# EAGLE design base-1 (EAGLE 9.3.1)
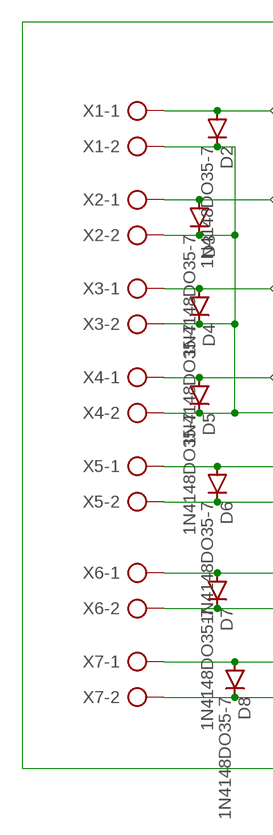
[diagram p0: schematic, sheet 1, part 1 of 2]
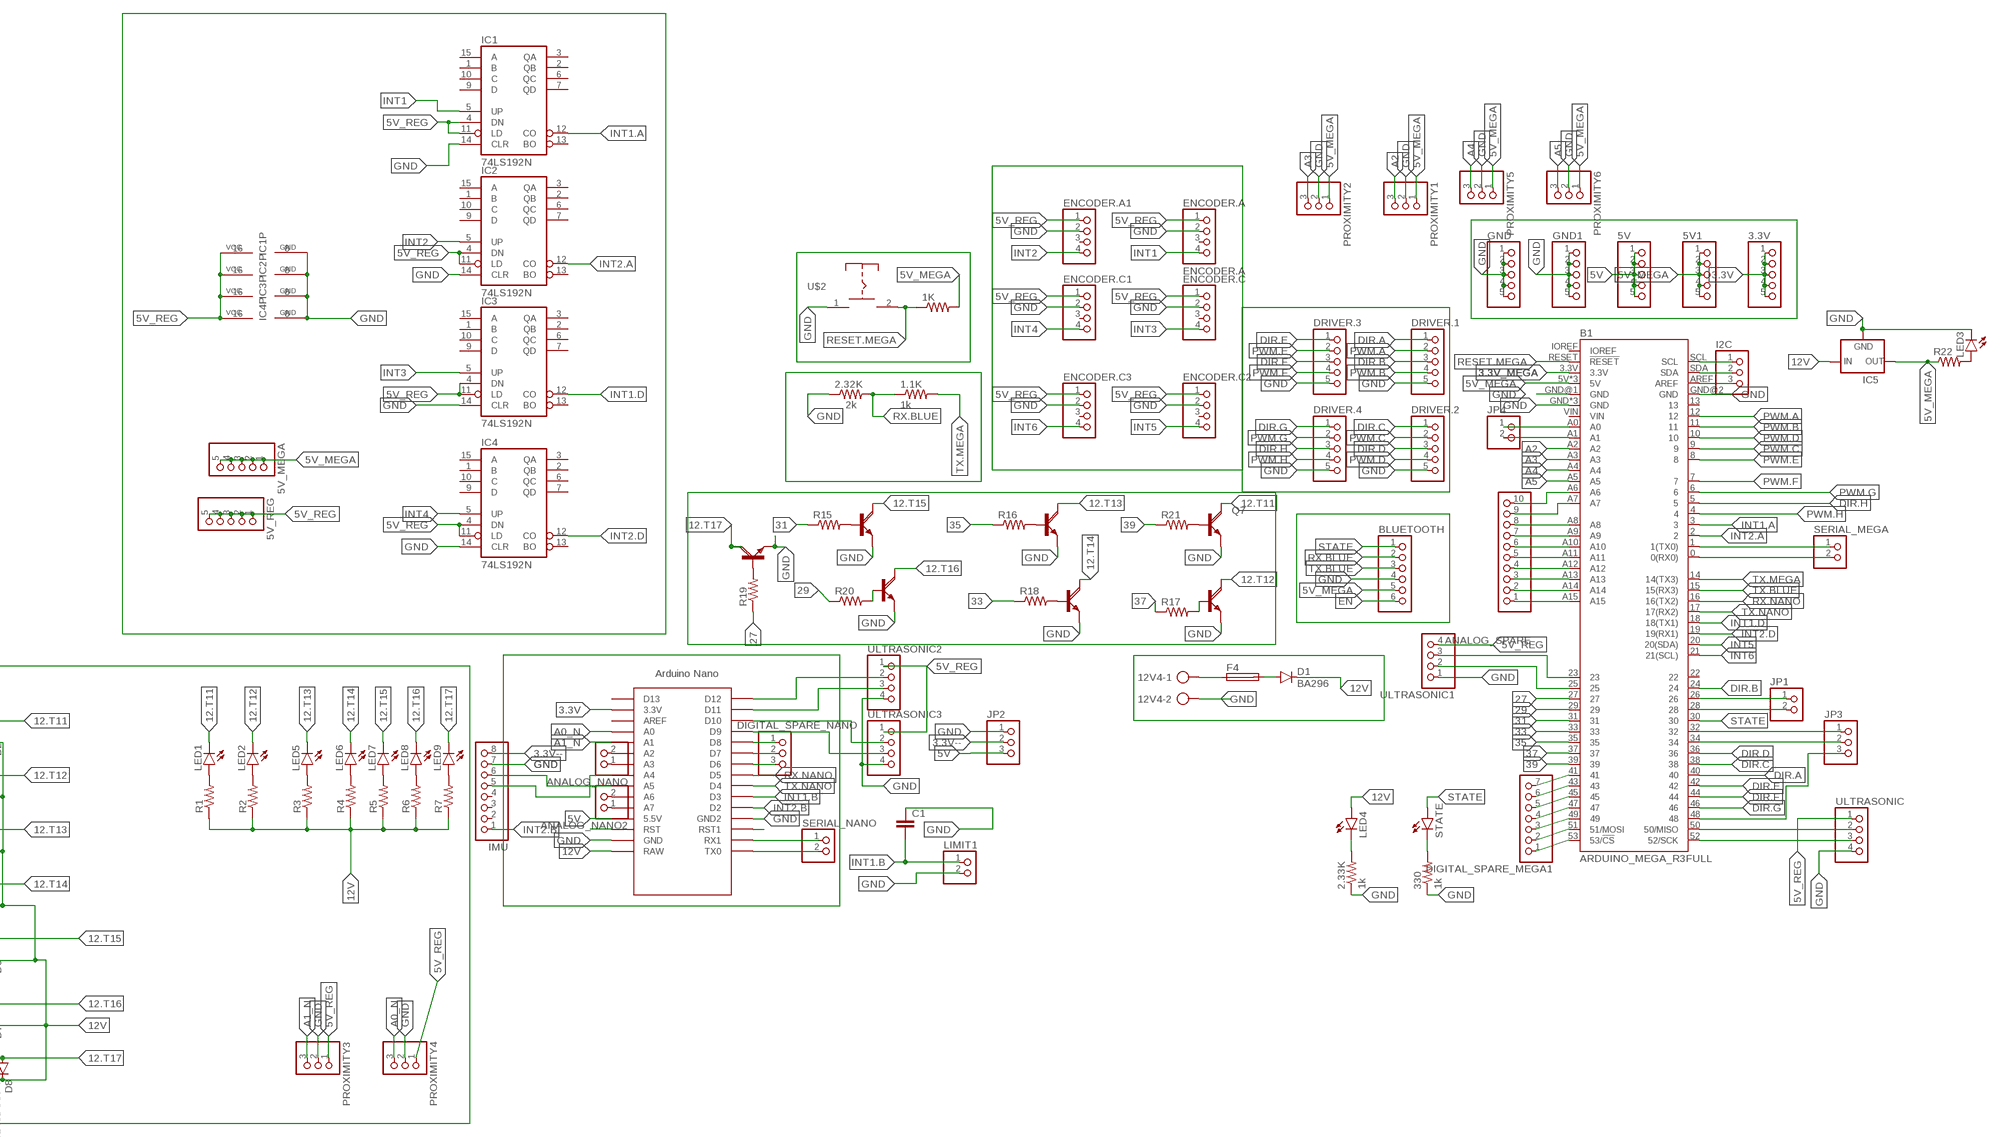
[diagram p1: schematic, sheet 1, part 2 of 2]

## Parts
1.1K  1k  R-US_0204/5  [0204/5]
1K  R-US_0204/5  [0204/5]
2.32K  2k  R-US_0204/5  [0204/5]
2.33K  1k  R-US_0207/10  [0207/10]
3.3V  PINHD-1X5  [1X05]
5V  PINHD-1X5  [1X05]
5V1  PINHD-1X5  [1X05]
5V_MEGA  PINHD-1X5  [1X05]
5V_REG  PINHD-1X5  [1X05]
12V4  W237-113  [W237-113]
330  1k  R-US_0204/5  [0204/5]
ANALOG_NANO  PINHD-1X2  [1X02]
ANALOG_NANO2  PINHD-1X2  [1X02]
ANALOG_SPARE  PINHD-1X10  [1X10]
B1  ARDUINO_MEGA_R3FULL  [ARDUINO_MEGA_NO_SILK]
BLUETOOTH  PINHD-1X6  [1X06]
C1  C-EU025-025X050  [C025-025X050]
D1  BA296  [P2-15]
D2  1N4148DO35-7  [DO35-7]
D3  1N4148DO35-7  [DO35-7]
D4  1N4148DO35-7  [DO35-7]
D5  1N4148DO35-7  [DO35-7]
D6  1N4148DO35-7  [DO35-7]
D7  1N4148DO35-7  [DO35-7]
D8  1N4148DO35-7  [DO35-7]
DIGITAL_SPARE_MEGA1  PINHD-1X7  [1X07]
DIGITAL_SPARE_NANO  PINHD-1X3  [1X03]
DRIVER.1  PINHD-1X5  [1X05]
DRIVER.2  PINHD-1X5  [1X05]
DRIVER.3  PINHD-1X5  [1X05]
DRIVER.4  PINHD-1X5  [1X05]
ENCODER.A  ENCODER.A  PINHD-1X4  [1X04]
ENCODER.A1  PINHD-1X4  [1X04]
ENCODER.C  PINHD-1X4  [1X04]
ENCODER.C1  PINHD-1X4  [1X04]
ENCODER.C2  PINHD-1X4  [1X04]
ENCODER.C3  PINHD-1X4  [1X04]
F4  SH22,5A  [SH22,5A]
GND  PINHD-1X5  [1X05]
GND1  PINHD-1X5  [1X05]
I2C  PINHD-1X3  [1X03]
IC1  74LS192N  [DIL16]
IC2  74LS192N  [DIL16]
IC3  74LS192N  [DIL16]
IC4  74LS192N  [DIL16]
IC5  79XX-TO3  [TO3-79]
IMU  PINHD-1X8  [1X08]
JP1  PINHD-1X2  [1X02]
JP2  PINHD-1X3  [1X03]
JP3  PINHD-1X3  [1X03]
JP4  PINHD-1X2  [1X02]
LED1  LED3MM  [LED3MM]
LED2  LED3MM  [LED3MM]
LED3  LED3MM  [LED3MM]
LED4  LED5MM  [LED5MM]
LED5  LED3MM  [LED3MM]
LED6  LED3MM  [LED3MM]
LED7  LED3MM  [LED3MM]
LED8  LED3MM  [LED3MM]
LED9  LED3MM  [LED3MM]
LIMIT1  PINHD-1X2  [1X02]
PROXIMITY1  PINHD-1X3  [1X03]
PROXIMITY2  PINHD-1X3  [1X03]
PROXIMITY3  PINHD-1X3  [1X03]
PROXIMITY4  PINHD-1X3  [1X03]
PROXIMITY5  PINHD-1X3  [1X03]
PROXIMITY6  PINHD-1X3  [1X03]
Q1  TIP120  [TO220AV]
Q2  TIP120  [TO220AV]
Q3  TIP120  [TO220AV]
Q4  TIP120  [TO220AV]
Q5  TIP120  [TO220AV]
Q6  TIP120  [TO220AV]
Q7  TIP120  [TO220AV]
R1  R-US_0204/5  [0204/5]
R2  R-US_0204/5  [0204/5]
R3  R-US_0204/5  [0204/5]
R4  R-US_0204/5  [0204/5]
R5  R-US_0204/5  [0204/5]
R6  R-US_0204/5  [0204/5]
R7  R-US_0204/5  [0204/5]
R15  R-US_0207/10  [0207/10]
R16  R-US_0204/7  [0204/7]
R17  R-US_0204/7  [0204/7]
R18  R-US_0204/7  [0204/7]
R19  R-US_0204/7  [0204/7]
R20  R-US_0204/7  [0204/7]
R21  R-US_0204/5  [0204/5]
R22  R-US_0204/5  [0204/5]
SERIAL_MEGA  PINHD-1X2  [1X02]
SERIAL_NANO  PINHD-1X2  [1X02]
STATE  LED3MM  [LED3MM]
U$1  NANO  [NANO]
U$2  PUSHBOTTON  [PUSHBOTTON]
ULTRASONIC  PINHD-1X4  [1X04]
ULTRASONIC1  PINHD-1X4  [1X04]
ULTRASONIC2  PINHD-1X4  [1X04]
ULTRASONIC3  PINHD-1X4  [1X04]
X1  AK300/2  [AK300/2]
X2  AK300/2  [AK300/2]
X3  AK300/2  [AK300/2]
X4  AK300/2  [AK300/2]
X5  AK300/2  [AK300/2]
X6  AK300/2  [AK300/2]
X7  AK300/2  [AK300/2]

## Nets
3.3V: 3.3V.1 3.3V.2 3.3V.3 3.3V.4 3.3V.5 U$1.3.3V
3.3V--: IMU.8 JP2.2
3.3V_MEGA: B1.3.3V
5V: 5V.1 5V.2 5V.3 5V.4 5V.5 JP2.3 U$1.5V(5.5V)
5V_MEGA: 1K.2 5V1.1 5V1.2 5V1.3 5V1.4 5V1.5 5V_MEGA.1 5V_MEGA.2 5V_MEGA.3 5V_MEGA.4 5V_MEGA.5 B1.5V B1.5V@1(5V) B1.5V@2(5V) BLUETOOTH.5 IC5.1(OUT) PROXIMITY1.1 PROXIMITY2.1 PROXIMITY5.1 PROXIMITY6.1 R22.1
5V_REG: 5V_REG.1 5V_REG.2 5V_REG.3 5V_REG.4 5V_REG.5 ENCODER.A1.1 ENCODER.A.1 ENCODER.C1.1 ENCODER.C2.1 ENCODER.C3.1 ENCODER.C.1 IC1.4(DN) IC1.11(LD) IC1.16(VCC) IC2.4(DN) IC2.11(LD) IC2.16(VCC) IC3.4(DN) IC3.11(LD) IC3.16(VCC) IC4.4(DN) IC4.11(LD) IC4.16(VCC) PROXIMITY3.1 PROXIMITY4.1 ULTRASONIC1.4 ULTRASONIC2.1 ULTRASONIC3.1 ULTRASONIC.1
12.T11: D2.A LED1.K(C) Q7.C X1.1
12.T12: D3.A LED2.K(C) Q5.C X2.1
12.T13: D4.A LED5.K(C) Q2.C X3.1
12.T14: D5.A LED6.K(C) Q4.C X4.1
12.T15: D6.A LED7.K(C) Q1.C X5.1
12.T16: D7.A LED8.K(C) Q6.C X6.1
12.T17: D8.A LED9.K(C) Q3.C X7.1
12V: D1.C D2.C D3.C D4.C D5.C D6.C D7.C D8.C IC5.3(IN) LED4.A R1.1 R2.1 R3.1 R4.1 R5.1 R6.1 R7.1 U$1.RAW X1.2 X2.2 X3.2 X4.2 X5.2 X6.2 X7.2
27: B1.27 R19.1
29: B1.29 R20.1
31: B1.31 R15.1
33: B1.33 R18.1
35: B1.35 R16.1
37: B1.37 R17.1
39: B1.39 R21.1
48: B1.48 JP3.3
A0_N: PROXIMITY4.3 U$1.A0
A1_N: PROXIMITY3.3 U$1.A1
A2: B1.A2 PROXIMITY1.3
A3: B1.A3 PROXIMITY2.3
A4: B1.A4 PROXIMITY5.3
A5: B1.A5 PROXIMITY6.3
DIR.A: B1.40 DRIVER.1.1
DIR.B: B1.24 DRIVER.1.3
DIR.C: B1.38 DRIVER.2.1
DIR.D: B1.36 DRIVER.2.3
DIR.E: B1.42 DRIVER.3.1
DIR.F: B1.44 DRIVER.3.3
DIR.G: B1.46 DRIVER.4.1
DIR.H: B1.5 DRIVER.4.3
EN: BLUETOOTH.6
GND: 2.32K.1 2.33K.1 12V4.2 330.1 B1.GND B1.GND@1(GND) B1.GND@2(GND) B1.GND@3(GND) B1.GND@4(GND) BLUETOOTH.4 C1.1 DRIVER.1.5 DRIVER.2.5 DRIVER.3.5 DRIVER.4.5 ENCODER.A1.2 ENCODER.A.2 ENCODER.C1.2 ENCODER.C2.2 ENCODER.C3.2 ENCODER.C.2 GND1.1 GND1.2 GND1.3 GND1.4 GND1.5 GND.1 GND.2 GND.3 GND.4 GND.5 IC1.8(GND) IC1.14(CLR) IC2.8(GND) IC2.14(CLR) IC3.8(GND) IC3.14(CLR) IC4.8(GND) IC4.14(CLR) IC5.2(GND) IMU.7 JP2.1 LED3.K(C) LIMIT1.2 PROXIMITY1.2 PROXIMITY2.2 PROXIMITY3.2 PROXIMITY4.2 PROXIMITY5.2 PROXIMITY6.2 Q1.E Q2.E Q3.E Q4.E Q5.E Q6.E Q7.E U$1.GND U$1.GND1(GND2) U$2.1 ULTRASONIC1.1 ULTRASONIC2.4 ULTRASONIC3.4 ULTRASONIC.4
INT1: ENCODER.A.4 IC1.5(UP)
INT1.A: B1.3 IC1.12(CO)
INT1.B: C1.2 LIMIT1.1 U$1.D3
INT1.D: B1.18(18(TX1)) IC3.12(CO)
INT2: ENCODER.A1.4 IC2.5(UP)
INT2.A: B1.2 IC2.12(CO)
INT2.B: IMU.1 U$1.D2
INT2.D: B1.19(19(RX1)) IC4.12(CO)
INT3: ENCODER.C.4 IC3.5(UP)
INT4: ENCODER.C1.4 IC4.5(UP)
INT5: B1.20(20(SDA)) ENCODER.C2.4
INT6: B1.21(21(SCL)) ENCODER.C3.4
N$1: B1.SCL I2C.1
N$2: B1.SDA I2C.2
N$3: B1.AREF I2C.3
N$6: ANALOG_SPARE.1 B1.A15
N$7: 12V4.1 F4.1
N$8: ANALOG_SPARE.2 B1.A14
N$9: ANALOG_SPARE.3 B1.A13
N$10: ANALOG_SPARE.4 B1.A12
N$11: ANALOG_SPARE.5 B1.A11
N$12: ANALOG_SPARE.6 B1.A10
N$13: ANALOG_SPARE.7 B1.A9
N$14: ANALOG_SPARE.8 B1.A8
N$15: ANALOG_SPARE.9 B1.A7
N$16: LED3.A R22.2
N$17: B1.1(1(TX0)) SERIAL_MEGA.1
N$18: B1.0(0(RX0)) SERIAL_MEGA.2
N$21: 330.2 STATE.K(C)
N$23: Q5.B R17.2
N$24: 2.33K.2 LED4.K(C)
N$25: D1.A F4.2
N$26: Q6.B R20.2
N$27: LED1.A R1.2
N$28: LED2.A R2.2
N$29: LED5.A R3.2
N$30: LED6.A R4.2
N$31: LED7.A R5.2
N$32: LED8.A R6.2
N$33: LED9.A R7.2
N$35: B1.23 ULTRASONIC1.3
N$36: B1.25 ULTRASONIC1.2
N$37: IMU.6 U$1.A5
N$38: IMU.5 U$1.A4
N$39: ANALOG_NANO.1 U$1.A3
N$40: ANALOG_NANO.2 U$1.A2
N$41: B1.50(50/MISO) ULTRASONIC.2
N$42: B1.52(52/SCK) ULTRASONIC.3
N$43: ANALOG_NANO2.1 U$1.A7
N$44: ANALOG_NANO2.2 U$1.A6
N$45: B1.A0 JP4.1
N$46: B1.26 JP1.1
N$47: ANALOG_SPARE.10 B1.A6
N$48: B1.A1 JP4.2
N$50: B1.28 JP1.2
N$54: B1.32 JP3.1
N$55: B1.34 JP3.2
N$60: Q1.B R15.2
N$61: Q2.B R16.2
N$62: Q4.B R18.2
N$63: Q3.B R19.2
N$64: Q7.B R21.2
N$75: B1.41 DIGITAL_SPARE_MEGA1.7
N$76: B1.45 DIGITAL_SPARE_MEGA1.5
N$77: B1.43 DIGITAL_SPARE_MEGA1.6
N$78: B1.47 DIGITAL_SPARE_MEGA1.4
N$79: B1.49 DIGITAL_SPARE_MEGA1.3
N$80: B1.51(51/MOSI) DIGITAL_SPARE_MEGA1.2
N$81: B1.53(53/!CS) DIGITAL_SPARE_MEGA1.1
N$119: U$1.RST
N$122: U$1.D12 ULTRASONIC2.2
N$123: U$1.D11 ULTRASONIC2.3
N$124: U$1.D10 ULTRASONIC3.2
N$125: U$1.D9 ULTRASONIC3.3
N$126: DIGITAL_SPARE_NANO.1 U$1.D8
N$127: DIGITAL_SPARE_NANO.2 U$1.D7
N$128: DIGITAL_SPARE_NANO.3 U$1.D6
N$134: U$1.RST1
N$135: SERIAL_NANO.1 U$1.RX1
N$136: SERIAL_NANO.2 U$1.TX0
PWM.A: B1.12 DRIVER.1.2
PWM.B: B1.11 DRIVER.1.4
PWM.C: B1.9 DRIVER.2.2
PWM.D: B1.10 DRIVER.2.4
PWM.E: B1.8 DRIVER.3.2
PWM.F: B1.7 DRIVER.3.4
PWM.G: B1.6 DRIVER.4.2
PWM.H: B1.4 DRIVER.4.4
RESET.MEGA: 1K.1 B1.RESET(!RESET) U$2.2
RX.BLUE: 1.1K.1 2.32K.2 BLUETOOTH.2
RX.NANO: B1.16(16(TX2)) U$1.D5
STATE: B1.30 BLUETOOTH.1 STATE.A
TX.BLUE: B1.15(15(RX3)) BLUETOOTH.3
TX.MEGA: 1.1K.2 B1.14(14(TX3))
TX.NANO: B1.17(17(RX2)) U$1.D4
Unconnected: B1.13 B1.22 B1.IOREF B1.VIN ENCODER.A1.3 ENCODER.A.3 ENCODER.C1.3 ENCODER.C2.3 ENCODER.C3.3 ENCODER.C.3 IC1.1(B) IC1.2(QB) IC1.3(QA) IC1.6(QC) IC1.7(QD) IC1.9(D) IC1.10(C) IC1.13(BO) IC1.15(A) IC2.1(B) IC2.2(QB) IC2.3(QA) IC2.6(QC) IC2.7(QD) IC2.9(D) IC2.10(C) IC2.13(BO) IC2.15(A) IC3.1(B) IC3.2(QB) IC3.3(QA) IC3.6(QC) IC3.7(QD) IC3.9(D) IC3.10(C) IC3.13(BO) IC3.15(A) IC4.1(B) IC4.2(QB) IC4.3(QA) IC4.6(QC) IC4.7(QD) IC4.9(D) IC4.10(C) IC4.13(BO) IC4.15(A) IMU.2 IMU.3 IMU.4 U$1.AREF U$1.D13

## Library data of the parts
1.1K 1K 2.32K 2.33K 330 R1-R7 R15-R22 = rcl:R-US_: RESISTOR, American symbol; SPICEPREFIX: R
3.3V 5V 5V1 5V_MEGA 5V_REG DRIVER.1-DRIVER.4 GND GND1 = pinhead:PINHD-1X5: PIN HEADER
12V4 = con-wago-500:W237-113: WAGO SCREW CLAMP; OC_FARNELL: unknown; OC_NEWARK: unknown
ANALOG_NANO ANALOG_NANO2 JP1 JP4 LIMIT1 SERIAL_MEGA SERIAL_NANO = pinhead:PINHD-1X2: PIN HEADER
ANALOG_SPARE = pinhead:PINHD-1X10: PIN HEADER
B1 = SparkFun-Boards:ARDUINO_MEGA_R3: Arduino Mega R3 ATmega2560 R3 compatible footprint. SparkFun Products: Arduino Mega 2560 R3 <https://www.sparkfun.com/products/11061>
BLUETOOTH = pinhead:PINHD-1X6: PIN HEADER
C1 = rcl:C-EU: CAPACITOR, European symbol; SPICEPREFIX: C
D1 = diode:BA296: DIODE
D2-D8 = diode:1N4148: DIODE high speed (Philips)
DIGITAL_SPARE_MEGA1 = pinhead:PINHD-1X7: PIN HEADER
DIGITAL_SPARE_NANO I2C JP2 JP3 PROXIMITY1-PROXIMITY6 = pinhead:PINHD-1X3: PIN HEADER
ENCODER.A ENCODER.A1 ENCODER.C ENCODER.C1-ENCODER.C3 ULTRASONIC ULTRASONIC1-ULTRASONIC3 = pinhead:PINHD-1X4: PIN HEADER
F4 = fuse:SH22,5A: FUSE HOLDER grid 22,5mm, isolated cap OGN0031 8201, Schurter (Buerklin); MPN: 0031.7701.11; OC_FARNELL: unknown; OC_NEWARK: 04F1224
IC1-IC4 = 74xx-us:74*192: Synchronous 4-bit UP/DOWN COUNTER
IC5 = v-reg:79XX-TO3: VOLTAGE REGULATOR
IMU = pinhead:PINHD-1X8: PIN HEADER
LED1-LED9 STATE = led:LED: LED OSRAM: - CHIPLED LG R971, LG N971, LY N971, LG Q971, LY Q971, LO R971, LY R971 LH N974, LH R974 LS Q976, LO Q976, LY Q976 LO Q996 - Hyper CHIPLED LW Q18S LB Q993, LB Q99A, LB R99A - SideLED LS A670, LO A670, LY A670, LG A670, LP A670 LB A673, LV A673, LT A673, LW A673 LH A674 LY A675 LS A676, LA A676, LO A676, LY A676, LW A676 LS A679, LY A679, LG A679 - Hyper Micro SIDELED® LS Y876, LA Y876, LO Y876, LY Y876 LT Y87S - SmartLED LW L88C, LW L88S LB L89C, LB L89S, LG L890 LS L89K, LO L89K, LY L89K LS L896, LA L896, LO L896, LY L896 - TOPLED LS T670, LO T670, LY T670, LG T670, LP T670 LSG T670, LSP T670, LSY T670, LOP T670, LYG T670 LG T671, LOG T671, LSG T671 LB T673, LV T673, LT T673, LW T673 LH T674 LS T676, LA T676, LO T676, LY T676, LB T676, LH T676, LSB T676, LW T676 LB T67C, LV T67C, LT T67C, LS T67K, LO T67K, LY T67K, LW E67C LS E67B, LA E67B, LO E67B, LY E67B, LB E67C, LV E67C, LT E67C LW T67C LS T679, LY T679, LG T679 LS T770, LO T770, LY T770, LG T770, LP T770 LB T773, LV T773, LT T773, LW T773 LH T774 LS E675, LA E675, LY E675, LS T675 LS T776, LA T776, LO T776, LY T776, LB T776 LHGB T686 LT T68C, LB T68C - Hyper Mini TOPLED® LB M676 - Mini TOPLED Santana® LG M470 LS M47K, LO M47K, LY M47K Source: http://www.osram.convergy.de LUXEON: - LUMILED® LXK2-PW12-R00, LXK2-PW12-S00, LXK2-PW14-U00, LXK2-PW14-V00 LXK2-PM12-R00, LXK2-PM12-S00, LXK2-PM14-U00 LXK2-PE12-Q00, LXK2-PE12-R00, LXK2-PE12-S00, LXK2-PE14-T00, LXK2-PE14-U00 LXK2-PB12-K00, LXK2-PB12-L00, LXK2-PB12-M00, LXK2-PB14-N00, LXK2-PB14-P00, LXK2-PB14-Q00 LXK2-PR12-L00, LXK2-PR12-M00, LXK2-PR14-Q00, LXK2-PR14-R00 LXK2-PD12-Q00, LXK2-PD12-R00, LXK2-PD12-S00 LXK2-PH12-R00, LXK2-PH12-S00 LXK2-PL12-P00, LXK2-PL12-Q00, LXK2-PL12-R00 Source: www.luxeon.com KINGBRIGHT: KA-3528ASYC Source: www.kingbright.com
Q1-Q7 = transistor-power:TIP120: NPN DARLINGTON TRANSISTOR
U$1 = Arduino-clone:NANO: Arduino Nano
U$2 = push botton:PUSHBOTTON
X1-X7 = con-ptr500:AK300/2: CONNECTOR; OC_FARNELL: unknown; OC_NEWARK: unknown

## Board
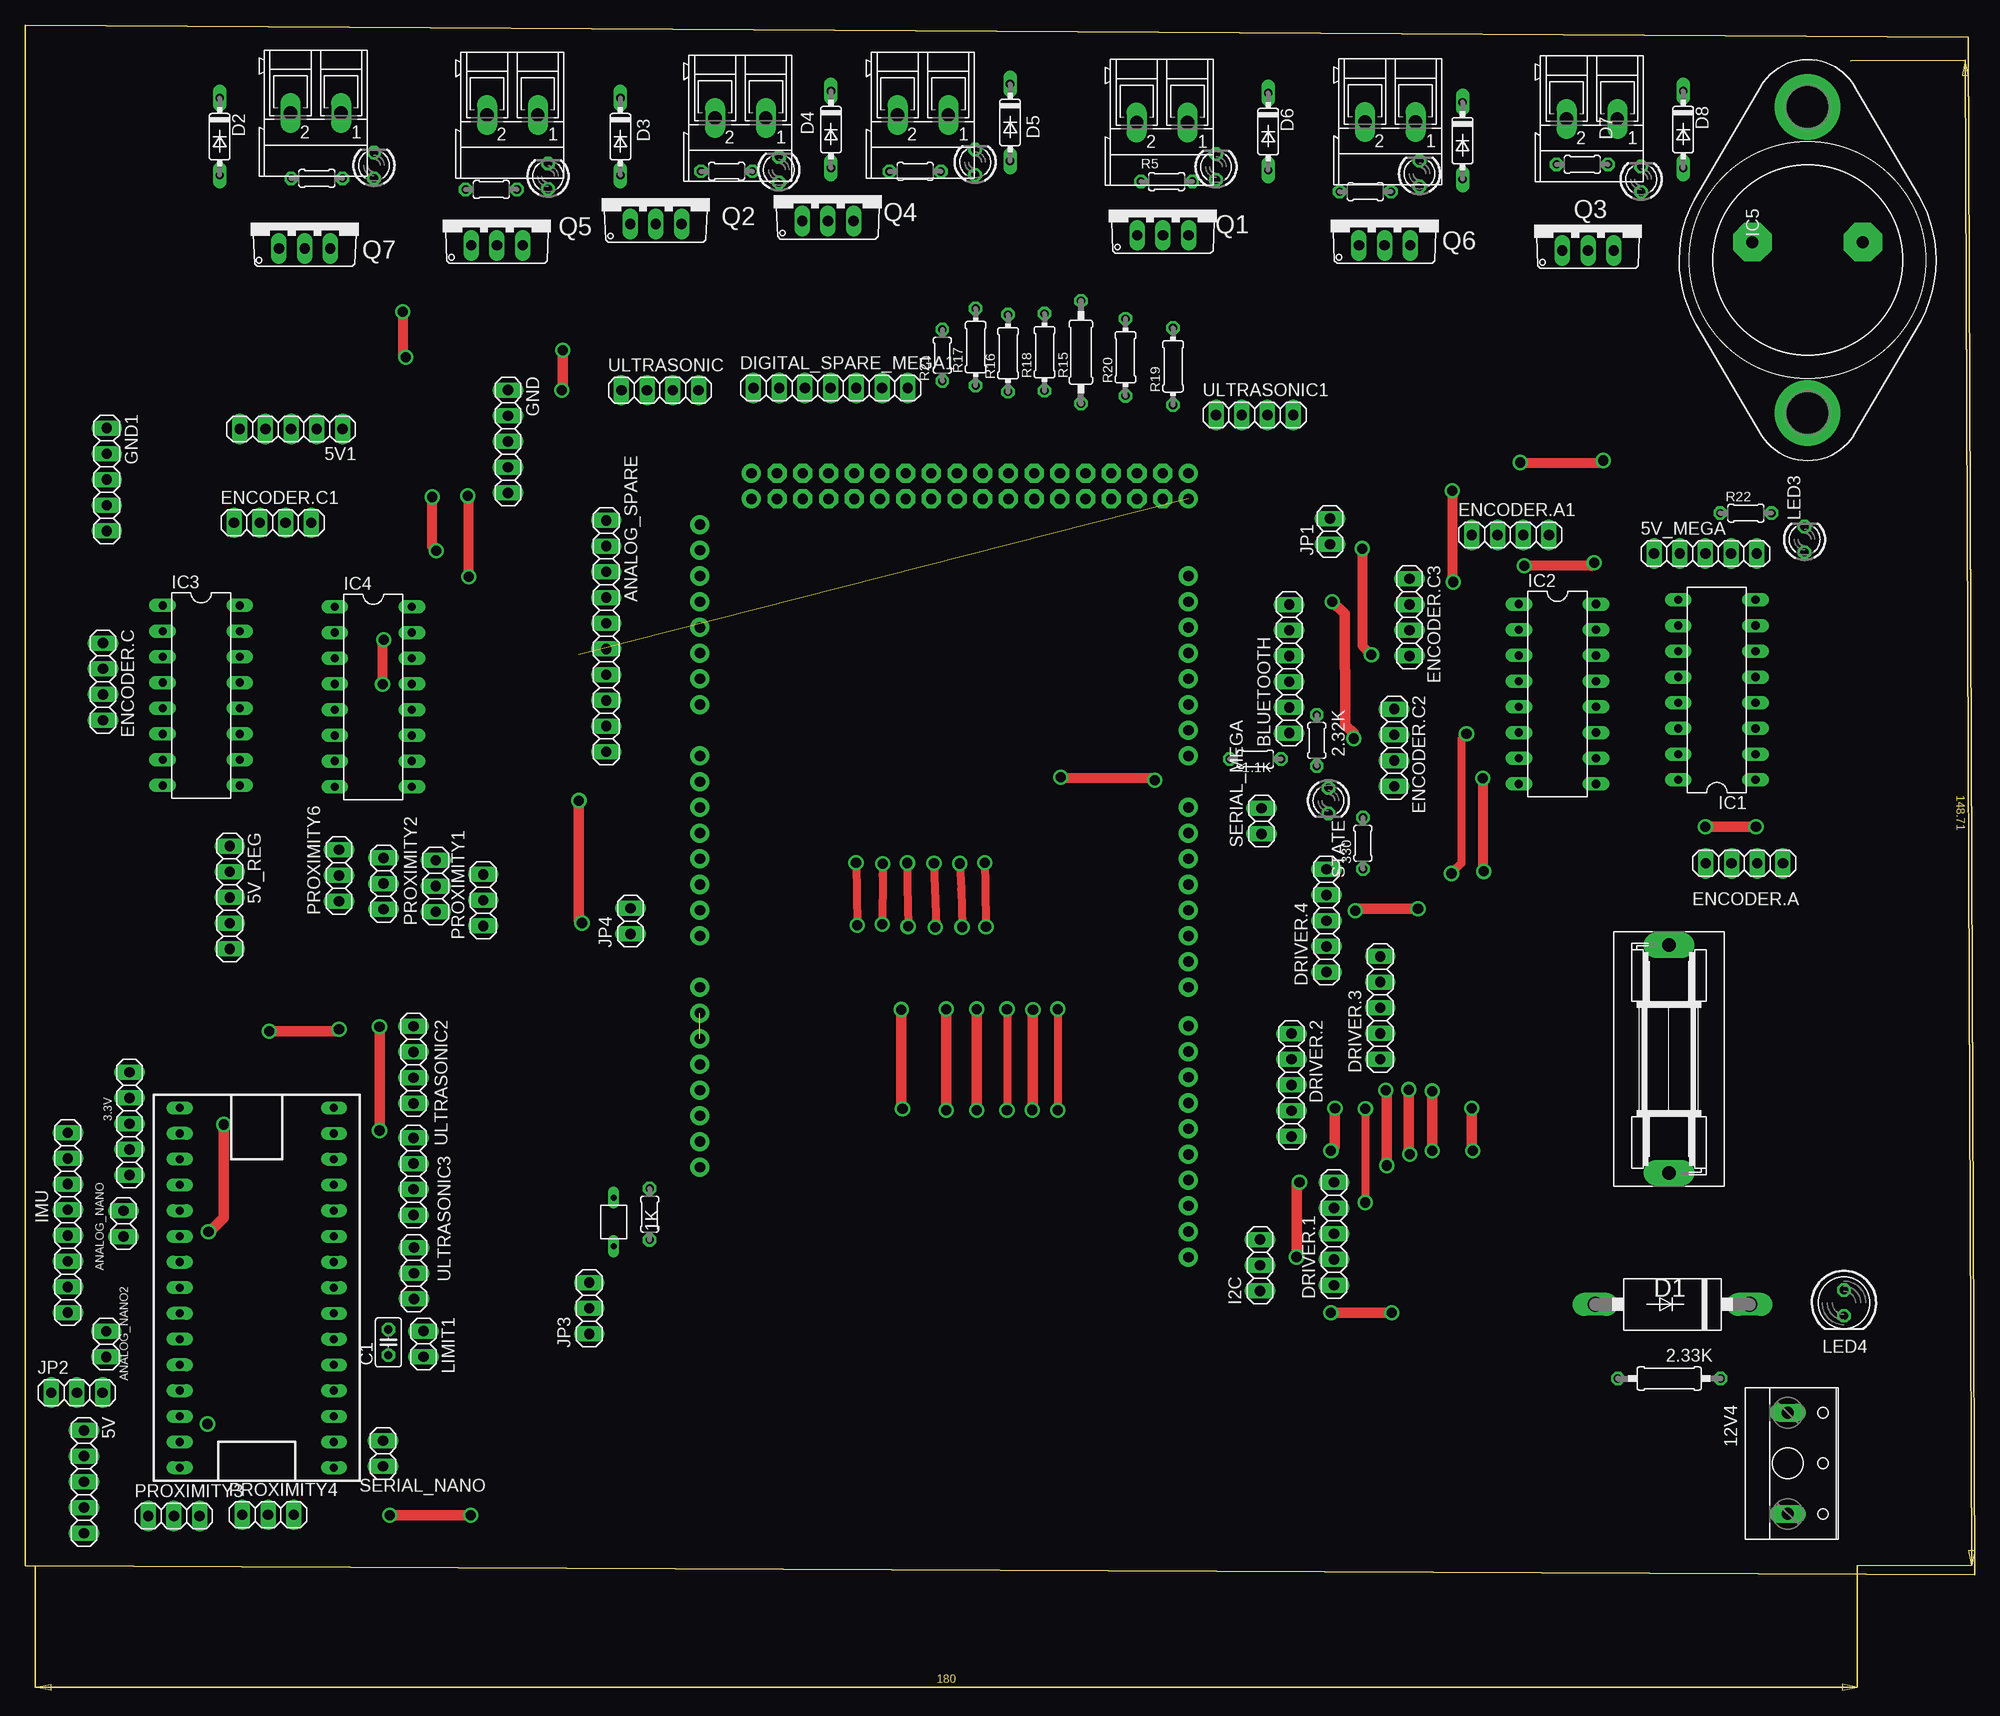
[diagram p2: board, top side]
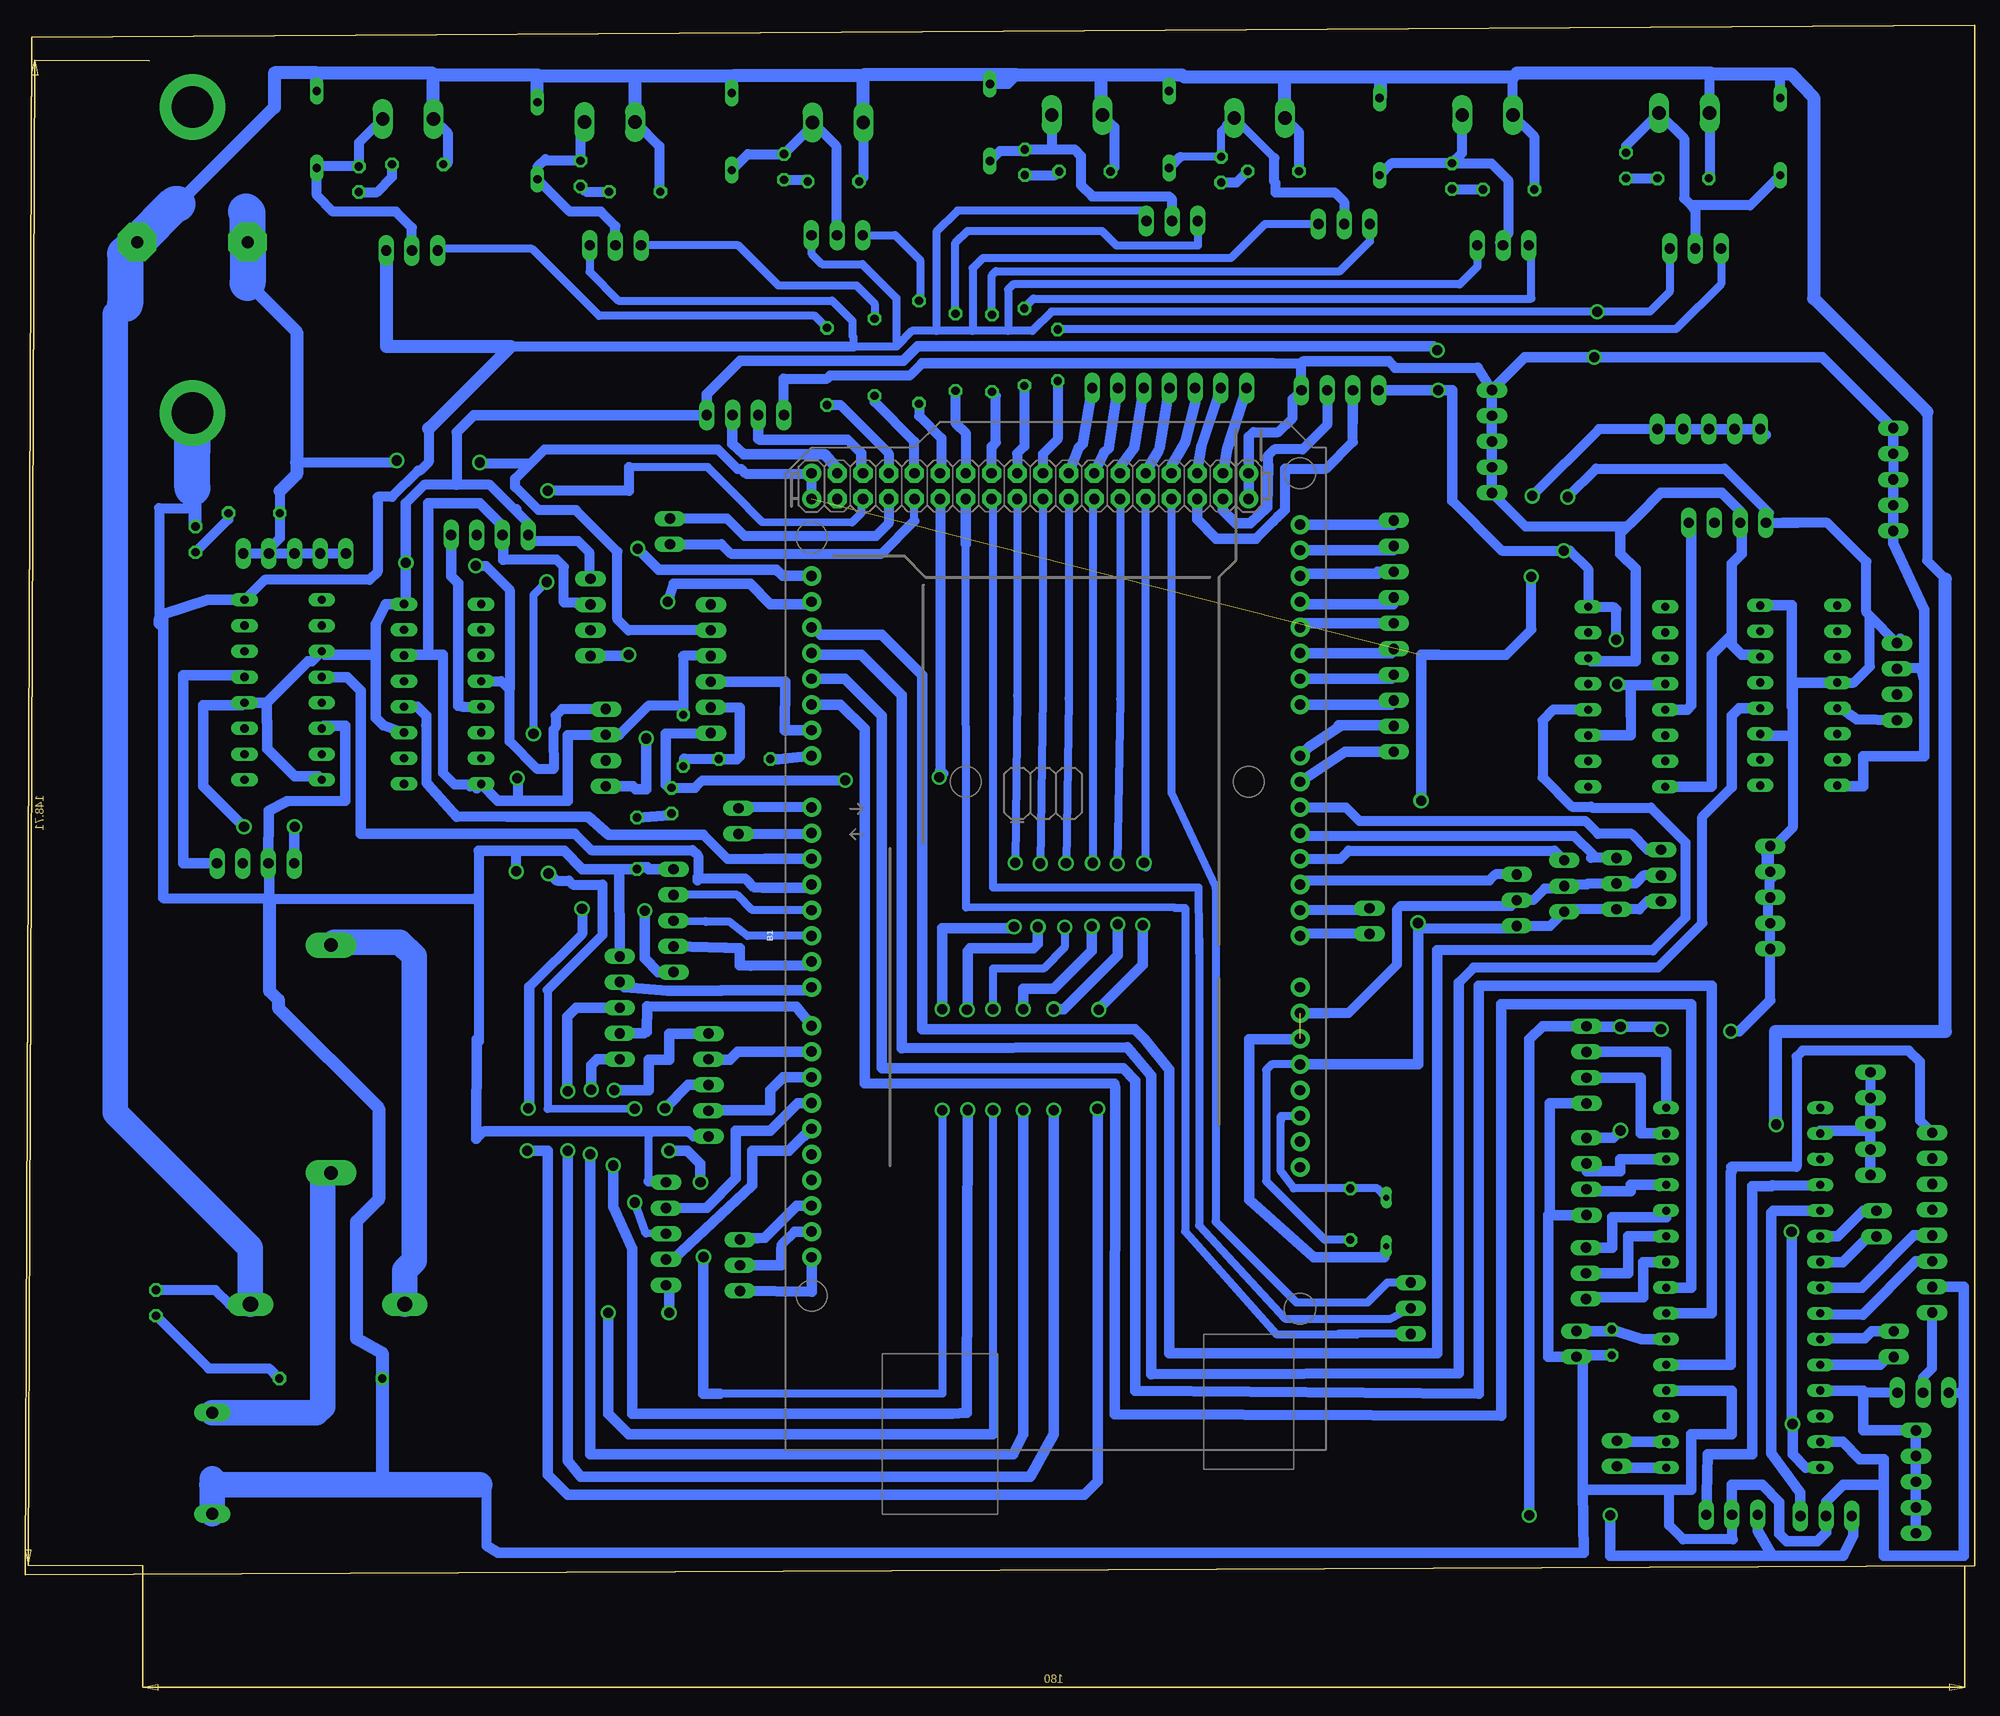
[diagram p3: board, bottom side, seen from below]

Size 192.6 x 153.1 mm. Coordinates in mm from the lower left corner, seen from the top.
Outline: 0,0.9 192.6,0 191.96,151.91 0,153.1 0,0.9
Copper layers (1*16): Top 0.035mm / dielectric 1.5mm / Bottom 0.035mm
Design rules "default *": minimum track width 1mm, minimum drill 1mm, track to track 0.4mm, track to pad 0.4mm, pad to pad 6mil, via to via 6mil, smd to smd 6mil, copper to edge 0.6mm, drill to drill 6mil, minimum pad ring 10mil, minimum via ring 8mil, stop-mask expansion 4mil, vias tented up to drill 0mil, thermal gap 10mil

### Footprints (pad centres in the part's own frame; a part is rotated, then mirrored left to right if it is on the bottom)
0204/5 = drill 0.813 octagon: 1 -2.54,0; 2 2.54,0
0207/10 = drill 0.813 octagon: 1 -5.08,0; 2 5.08,0
1X05 = drill 1.016 long: 1 -5.08,0; 2 -2.54,0; 3 0,0; 4 2.54,0; 5 5.08,0
W237-113 = drill 1.194 long: 1 -5,-1.27; 2 5,-1.27
1X02 = drill 1.016 long: 1 -1.27,0; 2 1.27,0
1X10 = drill 1.016 long: 1 -11.43,0; 2 -8.89,0; 3 -6.35,0; 4 -3.81,0; 5 -1.27,0; 6 1.27,0; 7 3.81,0; 8 6.35,0; 9 8.89,0; 10 11.43,0
ARDUINO_MEGA_NO_SILK = drill 1.016 pad 1.88: 0 13.97,24.13; 1 11.43,24.13; 2 8.89,24.13; 3 6.35,24.13; 3.3V -13.97,-24.13; 4 3.81,24.13; 5 1.27,24.13; 5V -11.43,-24.13; 5V@1 44.45,24.13; 5V@2 46.99,24.13; 6 -1.27,24.13; 7 -3.81,24.13; 8 -7.62,24.13; 9 -10.16,24.13; 10 -12.7,24.13; 11 -15.24,24.13; 12 -17.78,24.13; 13 -20.32,24.13; 14 19.05,24.13; 15 21.59,24.13; 16 24.13,24.13; 17 26.67,24.13; 18 29.21,24.13; 19 31.75,24.13; 20 34.29,24.13; 21 36.83,24.13; A0 1.27,-24.13; A1 3.81,-24.13; A2 6.35,-24.13; A3 8.89,-24.13; A4 11.43,-24.13; A5 13.97,-24.13; A6 16.51,-24.13; A7 19.05,-24.13; A8 24.13,-24.13; A9 26.67,-24.13; A10 29.21,-24.13; A11 31.75,-24.13; A12 34.29,-24.13; A13 36.83,-24.13; A14 39.37,-24.13; A15 41.91,-24.13; AREF -25.4,24.13; GND -8.89,-24.13; GND@1 -6.35,-24.13; GND@2 44.45,-19.05; GND@3 46.99,-19.05; GND@4 -22.86,24.13; IOREF -19.05,-24.13; NC -21.59,-24.13; RESET -16.51,-24.13; SCL -30.48,24.13; SDA -27.94,24.13; VIN -3.81,-24.13 | drill 1.016 pad 1.88 octagon: 22 44.45,21.59; 23 46.99,21.59; 24 44.45,19.05; 25 46.99,19.05; 26 44.45,16.51; 27 46.99,16.51; 28 44.45,13.97; 29 46.99,13.97; 30 44.45,11.43; 31 46.99,11.43; 32 44.45,8.89; 33 46.99,8.89; 34 44.45,6.35; 35 46.99,6.35; 36 44.45,3.81; 37 46.99,3.81; 38 44.45,1.27; 39 46.99,1.27; 40 44.45,-1.27; 41 46.99,-1.27; 42 44.45,-3.81; 43 46.99,-3.81; 44 44.45,-6.35; 45 46.99,-6.35; 46 44.45,-8.89; 47 46.99,-8.89; 48 44.45,-11.43; 49 46.99,-11.43; 50 44.45,-13.97; 51 46.99,-13.97; 52 44.45,-16.51; 53 46.99,-16.51
1X06 = drill 1.016 long: 1 -6.35,0; 2 -3.81,0; 3 -1.27,0; 4 1.27,0; 5 3.81,0; 6 6.35,0
C025-025X050 = drill 0.813 octagon: 1 -1.27,0; 2 1.27,0
P2-15 = drill 1.499 long: A 7.62,0; C -7.62,0
DO35-7 = drill 0.813 long: A 3.81,0; C -3.81,0
1X07 = drill 1.016 long: 1 -7.62,0; 2 -5.08,0; 3 -2.54,0; 4 0,0; 5 2.54,0; 6 5.08,0; 7 7.62,0
1X03 = drill 1.016 long: 1 -2.54,0; 2 0,0; 3 2.54,0
1X04 = drill 1.016 long: 1 -3.81,0; 2 -1.27,0; 3 1.27,0; 4 3.81,0
SH22,5A = drill 1.321 pad 2.54 long: 1 -11.252,0; 2 11.252,0
DIL16 = drill 0.813 long: 1 -8.89,-3.81; 2 -6.35,-3.81; 3 -3.81,-3.81; 4 -1.27,-3.81; 5 1.27,-3.81; 6 3.81,-3.81; 7 6.35,-3.81; 8 8.89,-3.81; 9 8.89,3.81; 10 6.35,3.81; 11 3.81,3.81; 12 1.27,3.81; 13 -1.27,3.81; 14 -3.81,3.81; 15 -6.35,3.81; 16 -8.89,3.81
TO3-79 = drill 1.194 pad 3.81 octagon: 1 -1.778,-5.461; 3 -1.778,5.461 | drill 4.115 pad 6.477: 2 15.113,0; 3@ -15.113,0
1X08 = drill 1.016 long: 1 -8.89,0; 2 -6.35,0; 3 -3.81,0; 4 -1.27,0; 5 1.27,0; 6 3.81,0; 7 6.35,0; 8 8.89,0
LED3MM = drill 0.813 octagon: A -1.27,0; K 1.27,0
LED5MM = drill 0.813 octagon: A -1.27,0; K 1.27,0
TO220AV = drill 1.016 long: B -2.54,-2.54; C 0,-2.54; E 2.54,-2.54
0204/7 = drill 0.813 octagon: 1 -3.81,0; 2 3.81,0
NANO = drill 0.8 long: 3.3V -10.16,24.13; 5V -10.16,-1.27; A0 -10.16,19.05; A1 -10.16,16.51; A2 -10.16,13.97; A3 -10.16,11.43; A4 -10.16,8.89; A5 -10.16,6.35; A6 -10.16,3.81; A7 -10.16,1.27; AREF -10.16,21.59; D2 5.08,1.27; D3 5.08,3.81; D4 5.08,6.35; D5 5.08,8.89; D6 5.08,11.43; D7 5.08,13.97; D8 5.08,16.51; D9 5.08,19.05; D10 5.08,21.59; D11 5.08,24.13; D12 5.08,26.67; D13 -10.16,26.67; GND -10.16,-6.35; GND1 5.08,-1.27; RAW -10.16,-8.89; RST -10.16,-3.81; RST1 5.08,-3.81; RX1 5.08,-6.35; TX0 5.08,-8.89
PUSHBOTTON = drill 0.6 long: 1 -12.43,5.08; 2 -7.62,5.08
AK300/2 = drill 1.321 long: 1 -2.515,0; 2 2.489,0

### Placement (x,y rotation side)
1.1K  121.54,80.6 180 top
1K  61.69,35.64 270 top
2.32K  127.6,82.44 270 top
2.33K  162.42,19.4 0 top
3.3V  10.3,44.58 90 top
5V  5.8,9.19 270 top
5V1  26.26,113.2 180 top
5V_MEGA  166,100.9 0 top
5V_REG  20.2,66.93 270 top
12V4  175.41,11.02 270 top
330  132.16,72.28 90 top
ANALOG_NANO  9.7,34.7 90 top
ANALOG_NANO2  8,22.8 90 top
ANALOG_SPARE  57.4,92.75 270 top
B1  90.79,61.86 90 bottom
BLUETOOTH  124.87,89.52 90 top
C1  35.87,22.97 90 top
D1  162.74,26.73 180 top
D2  19.2,142.1 270 top
D3  58.8,142.1 270 top
D4  79.6,142.8 270 top
D5  97.3,143.5 270 top
D6  122.8,142.6 270 top
D7  142,141.7 270 top
D8  163.8,142.8 270 top
DIGITAL_SPARE_MEGA1  79.56,117.26 0 top
DIGITAL_SPARE_NANO  38.4,29.8 270 top
DRIVER.1  129.3,33.7 90 top
DRIVER.2  125.1,48.4 270 top
DRIVER.3  133.87,56.03 90 top
DRIVER.4  128.55,64.63 90 top
ENCODER.A  169.85,70.3 0 top
ENCODER.A1  146.73,102.75 0 top
ENCODER.C  7.68,88.26 270 top
ENCODER.C1  24.44,103.95 0 top
ENCODER.C2  135.25,81.73 270 top
ENCODER.C3  136.75,94.6 270 top
F4  162.39,50.97 90 top
GND  47.7,111.98 270 top
GND1  8.05,108.22 270 top
I2C  122,30.59 90 top
IC1  167.13,87.44 90 top
IC2  151.38,87.03 270 top
IC3  17.38,86.89 270 top
IC4  34.38,86.75 270 top
IC5  176.1,129.9 270 top
IMU  4.2,34.8 270 top
JP1  128.9,103.1 270 top
JP2  5.1,18 0 top
JP3  55.72,26.34 90 top
JP4  59.8,64.6 90 top
LED1  34.45,139.25 90 top
LED2  51.65,138.19 90 top
LED3  175.8,102.3 90 top
LED4  179.69,26.87 270 top
LED5  74.45,138.83 90 top
LED6  93.85,139.57 90 top
LED7  117.65,139.11 90 top
LED8  137.75,138.45 90 top
LED9  159.65,137.89 90 top
LIMIT1  39.35,22.81 270 top
PROXIMITY1  45.25,66.66 90 top
PROXIMITY2  40.55,68.06 90 top
PROXIMITY3  14.68,5.81 0 top
PROXIMITY4  23.98,5.94 0 top
PROXIMITY5  35.4,68.3 90 top
PROXIMITY6  31,69.1 90 top
Q1  112.4,134.9 0 top
Q2  62.3,136 0 top
Q3  154.4,133.4 0 top
Q4  79.3,136.3 0 top
Q5  46.6,133.9 0 top
Q6  134.3,133.9 0 top
Q7  27.6,133.6 0 top
R1  28.81,137.98 0 top
R2  46.05,136.88 0 top
R3  69.29,138.68 0 top
R4  87.92,138.66 0 top
R5  112.76,137.66 0 top
R6  132.4,136.66 0 top
R7  153.84,139.36 0 top
R15  104.3,120.8 90 top
R16  97.1,120.7 90 top
R17  93.9,121.3 90 top
R18  100.7,120.8 90 top
R19  113.4,119.4 90 top
R20  108.7,120.3 90 top
R21  90.6,120.5 90 top
R22  170,104.9 0 top
SERIAL_MEGA  122.15,74.48 90 top
SERIAL_NANO  35.35,11.99 270 top
STATE  128.75,76.49 270 top
U$1  25.41,19.48 0 top
U$2  63.21,44.89 90 top
ULTRASONIC  62.71,117.04 0 top
ULTRASONIC1  121.46,114.59 0 top
ULTRASONIC2  38.35,50.39 270 top
ULTRASONIC3  38.35,39.36 270 top
X1  28.69,144.43 180 top
X2  48.12,144.23 180 top
X3  70.65,143.93 180 top
X4  88.68,144.23 180 top
X5  112.3,143.5 180 top
X6  134.85,143.56 180 top
X7  154.78,143.86 180 top

### Tracks (layer width: path | path; a pad name or v marks a point on that pad's centre or on a via)
3.3V
  Bottom 1: 3.3V.5 3.3V.4 10.3,47.1
  Bottom 1.016: 3.3V.1 3.3V.2 10.3,43.9 | 10.3,47.1 3.3V.3 10.3,43.9 | U$1.3.3V 15.25,43.9 10.3,43.9
3.3V--
  Bottom 1: JP2.2 5.1,19.5 4.2,20.4 IMU.8
5V
  Bottom 1: JP2.3 11.29,18 11.5,18.21
  Bottom 1.016: 5V.5 5V.4 5V.3 5V.2 5V.1 7.64,14.27 11,14.27 11,18.21 11.5,18.21 U$1.5V
5V_MEGA  (via drill 1)  (1 unrouted)
  Top 1: v43.8,98.6 43.8,106.5 v43.7,106.6 | v147.7,109.9 155.9,109.9 v155.9,110.1
  Top 1.016: v54.7,76.5 54.7,64.7 v55,64.4
  Bottom 0.813: 1K.2 64.2,33.1 70,38.9 70,49.9 69.47,50.43 B1.5V
  Bottom 1: 5V_MEGA.1 5V_MEGA.2 5V_MEGA.3 5V_MEGA.4 169,100.9 | 169,100.9 5V_MEGA.5 | 169,100.9 167.46,102.44 R22.1 167.46,107.08 | 53,90.9 46.3,90.9 43.8,93.4 v43.8,98.6 | v43.7,106.6 37.1,113.2 5V1.1 | BLUETOOTH.5 133.03,93.33 134.1,94.4 134.1,101.1 138.2,105.2 141.9,105.2 144.2,107.5 144.2,108.3 142.7,109.8 | 142.7,109.8 141.3,111.2 124.17,111.2 124.14,111.17 | 124.14,111.17 124.14,111.16 123.72,110.76 122.24,109.28 121.88,109.28 121.4,108.8 114.97,108.8 | 124.14,111.17 | 114.97,108.8 B1.5V@2 | B1.5V@1 114.92,108.75 114.97,108.8 | 142.7,109.8 147.6,109.8 v147.7,109.9 | v155.9,110.1 155.9,109.9 165.8,109.9 | v55,64.4 54.5,63.9 45.47,63.9 PROXIMITY1.1 41.95,64.12 PROXIMITY2.1 40.31,65.76 PROXIMITY5.1 33.14,65.76 32.34,66.56 PROXIMITY6.1 | 54.5,76.3 v54.7,76.5
  Bottom 1.016: 20.63,112.65 5V1.5 5V1.4 5V1.3 5V1.2 5V1.1 | B1.5V 55,50.47 v55,64.4 | v54.7,76.5 54.7,90.9 53,90.9
  Bottom 1.27: 170.64,127.64 165.8,122.8 165.8,109.9 165.8,108.74 167.46,107.08
  Bottom 3.54: 170.64,127.64 IC5.1 170.64,134.54 170.8,134.7
5V_REG  (via drill 1)
  Top 1: v155,100 154.7,99.7 v148.1,99.7 | v35.3,88 35.3,92.3 v35.4,92.4 | v40.6,101.2 40.2,101.6 v40.2,106.5
  Top 1.016: v36,5.9 v44,5.9 | v35,43.9 v35,54.15 | v31,53.9 30.8,53.7 v24.1,53.7 | v166,73.9 v171,73.9 | v53.1,121 53.1,117.14 v53,117.04
  Bottom 1: 150,112.9 150,107.7 | 150,107.7 153.2,107.7 155,105.9 | 51.64,106.1 46.74,101.2 v40.6,101.2 40,101.2 38.19,99.39 IC4.16 38.15,95.6 35.6,95.6 35.4,95.4 v35.4,92.4 | IC2.4 145.6,88.3 144.75,87.45 | v148.1,99.7 147.1,99.7 144.75,97.35 144.75,87.45 | 34,84.9 34,82.94 | 33.2,87.9 35.2,87.9 v35.3,88 | 136.9,98.41 136.9,101.05 138,102.15 142.32,102.15 ENCODER.A1.1 142.92,103.92 144.05,105.05 | ENCODER.C.1 10.36,94.75 | 10.36,94.75 10.7,95.09 10.7,100.1 14.55,103.95 18.9,103.95 ENCODER.C1.1 20.63,104.57 20.3,104.9 24.7,109.3 37.4,109.3 v40.2,106.5 | ENCODER.C2.1 139.56,85.54 140.2,84.9 140.2,83.76 140.43,83.52 140.43,83.51 140.44,83.51 140.43,82.93 140.42,79.6 142,79.6 144.75,82.35 144.75,87.45 | 144.05,105.05 144.05,105.3 | 144.05,105.05 146.7,107.7 150,107.7 | IC3.4 11.94,88.16 10.36,89.75 10.36,94.75 | 18,82.9 18,73.8 20.6,71.2 | 20.6,71.2 20.6,69.5 20.3,69.2 | 20,68.9 20.3,69.2 | 20.3,69.2 20.3,69.57 | 20.3,69.57 20.3,71.4 | 20.3,69.2 20.3,67.03 | 20.3,67.03 5V_REG.3 | 20.3,67.03 20.4,66.93 20.4,64.59 5V_REG.4 5V_REG.5 20.2,56.75 | 5V_REG.1 20.6,71.61 20.6,71.2 | 5V_REG.2 20.3,69.57
  Bottom 1.016: PROXIMITY3.1 12,5.67 12,3.9 13,1.9 20,1.9 | PROXIMITY4.1 21.44,4.34 20,1.9 | 20,1.9 36,1.9 v36,5.9 | v44,5.9 44,52.9 42.7,54.2 39,54.2 | 39,54.2 ULTRASONIC2.1 | ULTRASONIC3.1 35.73,43.17 v35,43.9 | 39,54.2 38.57,54.15 v35,54.15 31.25,54.15 v31,53.9 | 20.2,56.75 23.25,53.7 v24.1,53.7 | IC4.4 30.69,87.9 33.2,87.9 34,87.9 34,84.9 | IC4.11 34,82.94 | IC3.11 21,82.9 18,82.9 18,85.9 | 18,85.9 18,88.16 IC3.4 | 18,85.9 18.1,85.8 18.1,95.78 IC3.16 | ULTRASONIC.1 v53,117.04 51.64,117.03 51.64,106.1 | 158,90.9 158,93.9 156.98,95.92 IC2.16 155,96.11 v155,100 155,105.9 | 158,90.9 162.97,90.9 IC1.11 164.29,90.28 164.63,90.28 168.74,86.17 | 168.74,86.17 IC1.4 171.21,85.9 175,85.9 175,77.9 v171,73.9 | IC2.11 157.22,83.94 157.5,84.19 158,84.69 158,90.9 | IC1.16 163.67,78.9 166,78.9 168.71,81.61 168.71,84.28 168.74,84.31 168.74,86.17 | 150,112.9 148.31,114.59 ULTRASONIC1.4 125.27,116.63 121.95,119.95 105.88,119.95 104.43,121.4 53.5,121.4 v53.1,121 | ENCODER.A.1 166.04,73.86 v166,73.9 | 136.9,98.41 ENCODER.C3.1 | 7.38,92.47 7.38,92.37 ENCODER.C.1 | 17.54,103.95 18.9,103.95
12.T11
  Bottom 1: LED1.K 34.45,141.19 X1.1 28.7,141.93 28.7,136 28,135.3 | 28,135.3 27.6,134.9 Q7.C | D2.A 22.19,135.3 28,135.3
12.T12
  Bottom 1: LED2.K 50.63,140.47 X2.1 | Q5.C 46.9,131.66 46.1,132.46 46.1,137.8 47.76,139.46 LED2.K | LED2.K 57.63,139.46 D3.A
12.T13
  Bottom 0.813: 69.2,140 73.13,143.93 X3.1 74.45,142.65 LED5.K 78.49,140.1
  Bottom 1: X3.1 73.86,143.23 | 78.49,140.1 D4.A | Q2.C 62.3,135.66 63.24,136.6 69.1,136.6 69.1,137.5 69.2,137.6 69.2,140
12.T14
  Bottom 1: 91.15,143.54 91.15,144.19 X4.1 91.19,140.94 91.1,140.84 | D5.A 96.3,140.69 94,140.69 LED6.K 91.1,140.84 | Q4.C 79.3,135.9 79.6,136.2 87.2,136.2 88.3,137.3 88.3,140.2 88.94,140.84 91.1,140.84
12.T15
  Bottom 1: Q1.C 112.5,132.46 112.5,141.19 X5.1 114.81,143.22 LED7.K 121.21,140.38 D6.A
12.T16
  Bottom 1: Q6.C 134.3,133.26 135.74,134.7 138.81,134.7 D7.A 142,139.1 141.2,139.9 141.02,139.72 LED8.K 137.75,143.18 X6.1
12.T17
  Bottom 1: X7.1 159.65,141.5 LED9.K 163.63,139.16 D8.A 163.8,136.29 162.21,134.7 156,134.7 154.4,133.1 Q3.C
12V  (via drill 1)
  Top 1.016: v19.6,44.5 19.6,35.3 18.2,33.9 18.2,34 v18.1,33.9
  Bottom 1: 86.36,144.06 X4.2 | 26.1,148.4 26.2,148.3 X1.2 26.2,138.05 R1.1 | 45.2,148.4 45.63,147.97 X2.2 43.53,142.13 43.53,136.9 R2.1 | X4.2 86.3,144.34 | 132.36,147.96 132.5,148.1 | 152.29,148.39 152.3,148.4 152.4,148.4 152.4,148.31 152.29,148.2 | 66.66,138.77 R3.1 66.75,142.52 X3.2 | X4.2 84.99,143.03 84.99,139.05 R4.1 | X5.2 109.81,138.07 R5.1 | X6.2 129.96,141.16 129.96,136.76 R6.1 | X7.2 150.89,142.46 150.89,139.47 R7.1 | 142,148.1 142,148.2 | D5.C 95.49,147.31 94.6,148.2 94.61,148.21 | 78.2,148.3 78.3,148.2 78.07,147.97 | D2.C 19.2,148.3 | 122.8,148 122.7,148.1 | 68.16,147.81 68,147.97 | D3.C 58.7,146.01 | 109.81,148.21 109.81,148.1 | U$1.RAW 16.69,10.59 | 2.9,98.4 4.7,100.2 4.7,114.9 | 183.7,45.67 183.7,107.6 | D1.C 172.43,26.73 173.84,28.14 LED4.A
  Bottom 1.016: X6.2 132.36,144.74 132.3,144.8 | 16.69,10.59 18,11.9 v18,14.9 18.1,15 v18.1,33.9 | v19.6,44.5 19.7,44.6
  Bottom 1.27: 19.7,44.6 19.7,53.7 2.9,53.7 2.9,98.4 | 163.8,148.4 168,148.4 168,145 177.55,135.45 | 142,148.2 152.29,148.2 X7.2 | 94.61,148.21 109.81,148.21 | 94.6,148.2 86.3,148.2 | 86.3,148.2 79.6,148.2 | 79.6,148.2 78.3,148.2 | 45.2,148.4 26.1,148.4 | 26.2,148.3 19.2,148.3 18.14,148.3 15.91,145.97 15.91,126.11 4.7,114.9 | 86.3,144.34 86.3,148.2 | X6.2 132.36,147.96 | D8.C 163.8,148.4 | D7.C 142,148.1 132.5,148.1 122.7,148.1 109.81,148.1 X5.2 | D4.C 79.6,148.2 | D6.C 122.8,148 | 45.63,147.97 58.7,147.97 | 58.7,147.97 68,147.97 78.07,147.97 | X3.2 68.16,147.81 | 58.7,146.01 58.7,147.97 | 163.8,148.4 152.4,148.4
  Bottom 2.54: D1.C 170.36,32.33 183.7,45.67 183.7,124.6 182.75,125.55
  Bottom 3.54: 177.55,135.45 177.79,135.45 IC5.3 182.75,130.49 182.75,125.55
27
  Bottom 1: R19.1 112.09,115.59 107.3,110.8 B1.27
29
  Bottom 1: B1.29 104.76,111.96 108.7,115.9 R20.1
31
  Bottom 1: R15.1 104.3,114.5 102.1,112.3 102.1,108.97 B1.31
33
  Bottom 1: R18.1 100.7,113.8 99.68,112.78 B1.33
35
  Bottom 1: B1.35 97.14,111.46 96.7,111.9 96.7,116.49 R16.1
37
  Bottom 1: R17.1 93.9,111.5 94.6,110.8 B1.37
39
  Bottom 1: R21.1 90.6,112.2 92.06,110.74 B1.39
48
  Bottom 0.813: B1.48 79.36,77.26 75,67.9 75,34.9 67,26.9 60,26.9 58.02,28.88 JP3.3
A0_N
  Bottom 1: 20.1,38.4 20,38.5 15.28,38.5
  Bottom 1.016: PROXIMITY4.3 26.39,11.9 22,11.9 22,38.4 20.1,38.4 | U$1.A0 15.28,38.5
A1_N
  Bottom 1.016: PROXIMITY3.3 17.22,8.12 20.1,12.04 20.1,35.8 19.91,35.99 U$1.A1
A2
  Bottom 1: B1.A2 66.66,68.61 47.94,68.61 47.35,69.2 PROXIMITY1.3
A3
  Bottom 1: PROXIMITY2.3 41.5,71.55 61.86,71.55 62.66,70.75 B1.A3
A4
  Bottom 1: B1.A4 66.36,72.99 39.57,72.99 37.66,71.08 37.9,70.84 PROXIMITY5.3
A5
  Bottom 1: PROXIMITY6.3 32.34,71.64 33.9,73.2 37.2,73.2 38.5,74.5 60.8,74.5 62.13,75.83 B1.A5
DIR.A  (via drill 1)
  Top 0.813: v89.78,70.32 90,64.09 v89.91,63.98 | v97,55.9 v97,45.9
  Top 1.016: v135,25.9 v129,25.9
  Bottom 0.813: B1.40 89.52,86.57 v89.78,70.32 | v89.91,63.98 89.91,61.99 92,59.9 97,59.9 v97,55.9 | v97,45.9 97,13.9
  Bottom 1.016: 97,13.9 133,13.9 135,15.9 v135,25.9 | v129,25.9 129,28.32 DRIVER.1.1
DIR.B  (via drill 1)
  Top 0.813: v142.4,83.1 141.9,82.6 141.9,70.29 v140.91,69.3 | v132.38,36.79 v132.38,36.8 v132.41,46.04
  Top 1: v141,107.1 141,98.2 v141.1,98.1
  Bottom 0.813: B1.24 110,106.15 110,104.9 110.94,103.97 119.8,104.02 122.59,106.87 125.16,109.44 132.97,109.44 | v141.1,98.1 142.4,96.8 v142.4,83.1 | DRIVER.1.3 131.29,33.74 v132.38,36.79 | v132.41,46.04 141.01,46.01 141.01,57.8
  Bottom 1: v140.91,69.3 140.81,69.3 140.11,68.6 138.91,68.6 138.51,68.2 135.6,68.2 135.6,63.21 141.01,57.8 | 132.97,109.44 132.97,107.1 v141,107.1
DIR.C  (via drill 1)
  Top 0.813: v92.33,70.28 92.46,67.72 v92.56,64.02
  Top 1.016: v99.56,55.84 99.56,46 v99.5,45.93 | v134.41,47.89 134.51,47.79 v134.51,40.45
  Bottom 0.813: B1.38 92.06,86.88 v92.33,70.28
  Bottom 1.016: v99.5,45.93 99.59,16.03 101,15.9 131,15.9 132.61,15.92 132.61,32.22 134.51,36.36 v134.51,40.45 | DRIVER.2.1 129,53.48 129,50.9 131,50.9 131,47.9 v134.41,47.89 | v92.56,64.02 92.56,62.34 93,61.9 99.22,61.9 99.51,61.61 99.51,55.89 v99.56,55.84
DIR.D  (via drill 1)
  Top 0.813: v94.79,70.37 94.85,68.13 v94.92,64.02 | v102,55.9 v102,45.9
  Top 1.016: v125.9,38.8 125.6,38.5 v125.6,31.4 | v129.4,46.1 129.4,42.3 v129,41.9
  Bottom 0.813: B1.36 94.6,86.89 v94.79,70.37 | v102,45.9 102,17.9 124,17.9
  Bottom 1.016: 124,17.9 125.6,17.9 v125.6,31.4 | v125.9,38.8 125.9,40.6 127.2,41.9 v129,41.9 | v129.4,46.1 127.1,48.4 DRIVER.2.3 | v94.92,64.02 95.04,63.9 102,63.9 v102,55.9
DIR.E  (via drill 1)
  Top 0.813: v87.16,70.34 87.16,68.13 v87.22,64.07
  Top 1.016: v94,55.9 v94,45.9 | v136.7,47.95 136.7,41.65 v136.8,41.55
  Bottom 0.813: B1.42 87.16,106.13 v87.16,70.34
  Bottom 1.016: v87.22,64.07 87.22,61.68 91,57.9 94,57.9 v94,55.9 | v94,45.9 94,13.9 95,11.9 136.8,11.9 v136.8,41.55 | v136.7,47.95 136.7,50.35 136.1,50.95 DRIVER.3.1
DIR.F  (via drill 1)
  Top 0.813: v84.71,70.27 84.71,69.17 v84.67,64.28
  Top 1.016: v91,55.9 v91,45.9 | v139,47.8 v139,41.9
  Bottom 0.813: B1.44 84.44,86.54 v84.71,70.27
  Bottom 1.016: v84.67,64.28 84.67,61.23 90,55.9 v91,55.9 | v91,45.9 91,13.9 93.3,9.68 137.73,9.68 139,11.26 v139,41.9 | DRIVER.3.3 138.17,56.03 139.07,55.13 139.07,47.87 v139,47.8
DIR.G  (via drill 1)
  Top 0.813: v82.08,70.36 82.08,70.32 v82.2,64.2
  Top 1.016: v86.56,55.85 86.56,46.16 v86.66,46.06 | v142.9,46.1 142.9,42 v143,41.9 | v137.6,65.8 131.5,65.8 131.4,65.7 v131.4,65.6
  Bottom 0.813: 81.9,70 B1.46
  Bottom 1: v82.08,70.36 81.9,70.18 81.9,70 | 142.8,58.1 137.6,63.3 v137.6,65.8
  Bottom 1.016: v82.2,64.2 82.2,60.3 86.74,55.76 86.65,55.76 v86.56,55.85 | v86.66,46.06 86.66,9.24 88,7.9 139,7.9 141,9.9 141,41.9 v143,41.9 | 142.8,58.1 142.8,46.1 v142.9,46.1 | v131.4,65.6 131.4,60.9 130.05,59.55 DRIVER.4.1
DIR.H
  Bottom 0.813: B1.5 121.23,63.13 122.98,64.53 125.37,64.53 125.42,64.58 DRIVER.4.3
GND  (via drill 1)  (1 unrouted)
  Top 1: v144,78.7 144,69.6 v144.1,69.5 | v37.3,124.8 37.3,120.6 v37.6,120.3
  Bottom 0.813: 131,38.88 131,43.34 131,43.84 | Q6.E 136.84,128.74 134,125.9 112.9,125.9 110.9,123.9 110.9,122.4 110.8,122.3 110.8,121.36 106.54,121.36 | Q1.E 114.94,130.54 113.9,129.5 109.9,129.5 106.54,126.14 106.54,121.36 | 106.54,121.36 105,122.9 102.6,122.9 | Q7.E 30.14,126.76 32.1,124.8 v37.3,124.8 91.2,124.8 93.1,122.9 95.5,122.9 | 95.5,122.9 99,122.9 | 99,122.9 102.6,122.9 | Q5.E 49.14,129.26 50.9,127.5 95,127.5 95.5,127 95.5,122.9 | Q4.E 81.84,134.24 82.4,134.8 100.5,134.8 102.6,132.7 102.6,122.9 | Q2.E 70.14,133.46 73.5,130.1 98,130.1 99,129.1 99,122.9
  Bottom 1: BLUETOOTH.4 127.6,90.79 127.6,85.9 | 127.6,85.9 2.32K.1 | 127.6,85.9 131,85.9 133.9,83 ENCODER.C2.2 | 103.99,119.71 105.22,118.48 113.09,118.48 113.37,118.2 117.7,118.2 117.65,118.15 ULTRASONIC1.1 | LED3.K 175.8,104.87 176.33,105.4 179.37,105.4 179.37,94.53 179.42,94.48 179.42,93.9 179.42,94.48 179,94.9 | 147,2.9 147,8.9 147.7,8.9 | 174.2,8.9 174.7,8.4 174.7,8.94 174.14,9.5 | 147.8,71.54 147.8,66.4 | 147.8,66.4 147.8,52.7 148,52.9 | 110.8,121.36 144.64,121.36 | GND.5 44.4,103.6 34.3,103.6 33.2,104.7 | 65.1,119.9 66.4,119.9 66.52,119.78 | 57.9,119.9 57.25,119.25 49.12,119.25 | 151.34,79.24 | 148.65,77.9 148.85,78.1 150.2,78.1 151.05,78.95 151.34,79.24 | 137.9,95.87 138.1,96.07 139.4,96.07 139.4,99.6 140.1,100.3 145.39,100.3 | GND1.2 8.05,108.4 GND1.3 | LIMIT1.2 39.19,21.7 | PROXIMITY4.2 23.98,3.58 23.9,3.5 28.8,3.5 30.2,4.9 30.2,8.41 | 143.9,76.5 143.9,78.6 v144,78.7 | v144.1,69.5 144.1,71.54 | 147.8,66.4 148.22,66.82 168.5,66.82 178.92,66.82 179,66.9 | 147.34,43.77 148.03,43.09 | JP2.1 1.5,18 1.1,17.6 | 157.6,8.9 157.34,8.9 | IC1.8 168.97,98.3 158.6,98.3 157.8,99.1 157.8,106.5 156.39,106.5 153.79,109.1 153.6,109.1 152.75,109.95 152.75,113.25 | PROXIMITY6.2 32.7,69.1 33.5,68.3 PROXIMITY5.2 38.2,68.3 38.3,68.2 40.41,68.2 PROXIMITY2.2 40.81,67.8 42.5,67.8 43.64,66.66 PROXIMITY1.2 45.81,66.1 56.7,66.1 57.1,65.7 57.1,60.3 61.89,55.51 64,55.51 | 71.74,112.43 71.27,112.9 68.8,112.9 67.4,114.3 67.4,116.16 ULTRASONIC.4 66.52,119.78 | 69.29,119.71 66.59,119.71 66.52,119.78 | 151.34,90.9 151.34,79.24
  Bottom 1.016: 5.01,88.38 5.01,95.33 8.05,101.95 GND1.5 GND1.4 8.05,108.4 | ENCODER.C.2 5.28,89.62 5.01,88.38 | 38.75,8.41 30.2,8.41 28,8.41 28,13.9 24,13.9 24,18.17 28.81,18.17 31.05,18.21 U$1.GND1 | 38.75,8.41 38.75,21.54 LIMIT1.2 42.11,21.54 42.11,35.55 42,35.55 | 39.19,21.7 C1.1 | IMU.7 1.1,28.45 1.1,17.6 1.1,1.9 9,1.9 9,8.9 | U$1.GND 13.05,13.13 11.35,11.43 9,11.43 9,8.9 | 147.34,43.77 146,43.82 147.15,43.85 132,43.84 | 132,43.84 | 132,43.84 131.3,43.84 131,43.84 127.09,43.83 126.58,43.32 DRIVER.2.5 | PROXIMITY4.2 24,5.96 24,8.9 21,8.9 19.29,7.19 19.29,4.08 18.55,3.34 15.56,3.34 14.68,4.22 PROXIMITY3.2 14.68,7.22 13,8.9 9,8.9 | ULTRASONIC2.4 42,46.58 42,35.55 | ULTRASONIC3.4 42,35.55 | 38.75,8.41 38.62,2.2 145.87,2.2 147,2.9 | 148.03,43.09 148,52.9 | GND1.2 GND1.1 15.05,120.3 v37.6,120.3 44.46,120.3 GND.1 | 5.01,88.38 5,88.34 5,80.9 11,80.9 11,77.9 13.47,77.9 IC3.8 | IC3.14 21.39,90.9 23,90.9 24,91.9 24,92.9 | 24,92.9 24,99.9 23,100.9 23,103.12 | 23,103.9 23,103.12 | 23,103.12 ENCODER.C1.2 23.17,105.07 25,106.9 31,106.9 33.2,104.7 35,102.9 35,100.9 33.5,99.4 33.5,90.26 37.89,90.26 IC4.14 | 24,92.9 26,90.9 26,77.9 26.04,77.86 IC4.8 | GND.1 GND.2 GND.3 GND.4 GND.5 | 66.06,119.9 65.1,119.9 57.9,119.9 | 49.12,119.25 GND.1 | 71.74,112.43 B1.GND@3 B1.GND@2 | U$2.1 58.35,31.36 65.31,31.36 71.67,37.05 71.67,52.9 66.73,52.9 B1.GND | 330.1 132,69.9 131.17,69.9 131.03,69.71 DRIVER.4.5 | ENCODER.C2.2 139.02,82.94 138.99,76.5 143.9,76.5 145.93,76.5 IC2.8 | 145.39,100.3 145.39,102.28 ENCODER.A1.2 145.46,103.66 147.7,105.9 152.8,105.9 152.8,90.9 | 137.9,95.87 ENCODER.C3.2 | 148.65,77.9 IC2.8 | 152.8,90.9 151.34,90.9
  Bottom 1.016: 152.8,90.9 155.13,90.9 IC2.14 | 131,38.88 129.4,38.88 DRIVER.1.5 | IC1.14 163.05,83.9 161,83.9 161,76.46 166.73,76.45 168.56,75.48 ENCODER.A.2 168.5,69.8 168.5,66.82 | IC2.8 148,77.71 | IC1.8 174.57,96.33 179,94.9 179,66.9 | 330.1 133.9,69.73 DRIVER.3.5 | 147.8,71.54 144.1,71.54 139.36,71.54 137.56,69.74 330.1 | B1.GND@1 64,55.51 | 103.99,119.71 69.29,119.71 | 2.32K.1 127.6,84.9
  Bottom 1.27: Q3.E 156.94,121.36 144.64,121.36 152.75,113.25 | 168.5,66.82 168.5,57.7 167.6,56.8 167.6,56 157.7,46.1 157.7,37.1 159.9,34.9 159.9,23.36 157.34,21.94 2.33K.1 157.34,8.9 | LED3.K 175.8,107.1 175.8,114.6 176.1,114.9 IC5.2
  Bottom 2.54: 12V4.2 174.14,9.5 | 174.2,8.9 157.6,8.9 | 157.34,8.9 147.7,8.9 | 176.1,111.1 176.1,107.4 175.8,107.1
  Bottom 3.54: IC5.2 176.1,111.1 | 176.1,107.4 176.1,114.9 176.7,115.5
INT1
  Bottom 1.016: ENCODER.A.4 177,70.33 177,88.91 171.13,88.9 IC1.5
INT1.A
  Bottom 1: 138.33,73.24 136.7,71.61 126.7,71.61 126.13,71.04 126.13,69.02 126.2,68.95 126.2,68.6 125.98,68.82 121.48,68.82 120.57,67.9 119.72,67.9
  Bottom 1.016: IC1.12 160.81,88.71 159.47,87.37 159.47,73.24 138.33,73.24 | 119.72,67.9 115.23,67.9 B1.3
INT1.B
  Bottom 1.016: LIMIT1.1 36.03,24.08 C1.2 32.92,23.29 U$1.D3
INT1.D
  Bottom 1: 24,77.8 26.9,74.9 26.9,64.4 31.3,60 49.5,60 51,58.5
  Bottom 1.016: IC3.12 23.28,85.62 24,84.9 24,77.8 | 51,58.5 51,19.9 81.36,19.83 81.37,49.3 83.74,52.11 106.02,52.05 106.02,86.92 110,90.9 114.75,90.9 B1.18
INT2
  Bottom 1: IC2.5 146.91,85.76 146.88,85.73
  Bottom 1.016: 148,85.9 147.83,85.73 146.88,85.73 149.34,85.76 149.84,85.85 149.84,97.95 150.54,98.65 ENCODER.A1.4 | 147,85.9 147.43,85.9 IC2.5
INT2.A
  Bottom 1: 145,74.9 150,74.9 | 125.6,73.12 123.23,70.75 119.49,70.75 | 153,84.9 153,83.9 152.97,83.87 152.97,78.26 152.85,78.13
  Bottom 1.016: IC2.12 153.86,85.76 153,84.9 | 152.85,78.13 150,74.9 | 145,74.9 137,74.9 134.94,73.12 125.6,73.12 | 119.49,70.75 B1.2
INT2.B
  Bottom 1: IMU.1 5.4,44.89 5.4,50.7 6.5,51.8 17,51.8 17.6,51.2 17.6,40.3 24.1,40.3 24,40.2
  Bottom 1.016: 24,40.2 24,39.9 24.1,39.8 24.1,20.75 U$1.D2
INT2.D
  Bottom 1: IC4.12 41.62,85.48 42.7,84.4 42.7,78.8 39.8,75.9 37.92,75.9 37.82,75.8 32,75.8 28.58,72.38 28.58,64.92 31.8,61.7 53.1,61.7
  Bottom 1.016: 53.1,61.7 53.1,21.9 79.6,21.9 79.6,49.9 82,52.9 83,53.9 104,53.9 104,88.9 108,92.9 114,92.9 114.71,93.61 B1.19
INT3
  Bottom 1.016: ENCODER.C.4 11.64,84.54 13.25,85.65 13.54,85.65 IC3.5
INT4
  Bottom 1.016: ENCODER.C1.4 28,103.7 28,85.9 28.42,85.48 IC4.5
INT5  (via drill 1)
  Top 1.016: v131.25,82.63 131.25,83.13 130.44,83.94 130.37,94.96 v129.14,96.16
  Bottom 1.016: ENCODER.C2.4 132.58,77.92 132.28,77.62 131.25,77.63 v131.25,82.63 | v129.14,96.16 128.55,97.9 121,97.9 119,95.9 115,95.9 114.92,95.98 B1.20
INT6  (via drill 1)
  Top 1: v132.1,101.4 132.1,91.8 v133,90.9
  Top 1.016: v133,90.9 132.8,91.1
  Bottom 1.016: ENCODER.C3.4 133.11,90.79 v133,90.9 | v132.1,101.4 130.02,99.32 118.42,99.32 117.79,98.69 B1.21
N$1
  Bottom 1.016: B1.SCL 114.89,27.96 I2C.1
N$2
  Bottom 1: 116.6,33.9 117.9,32.6 117.9,32.2
  Bottom 1.016: I2C.2 117.9,30.59 117.9,32.2 | 116.6,33.9 114.92,33.9 B1.SDA
N$3
  Bottom 1: 120.3,33.26 120.34,33.3 119.56,33.3
  Bottom 1.016: B1.AREF 116.4,36.46 119.56,33.3 | I2C.3 122,33.26 120.3,33.26
N$6
  Bottom 1.016: ANALOG_SPARE.1 57.44,103.77 B1.A15
N$7
  Bottom 2.54: 12V4.1 163.84,16.02 163.24,16.62 163.24,39.72 F4.1
N$8
  Bottom 1.016: ANALOG_SPARE.2 57.44,101.23 B1.A14
N$9
  Bottom 1.016: ANALOG_SPARE.3 58.99,99.1 59,98.9 66.45,98.9 B1.A13
N$10
  Bottom 1.016: ANALOG_SPARE.4 57.44,95.9 66.41,95.9 B1.A12
N$11
  Bottom 1.016: B1.A11 66.25,94.02 ANALOG_SPARE.5
N$12
  Bottom 1.016: B1.A10 57.66,91.07 ANALOG_SPARE.6
N$13
  Bottom 1.016: B1.A9 57.66,88.53 ANALOG_SPARE.7
N$14
  Bottom 1.016: B1.A8 57.66,85.99 ANALOG_SPARE.8
N$15
  Bottom 1.016: ANALOG_SPARE.9 57.5,83.96 62.86,83.96 62.71,83.83 65.73,81.84 B1.A7
N$16
  Bottom 1: LED3.A 172.54,104.29 R22.2
N$17
  Bottom 1: SERIAL_MEGA.1 115,73.21 B1.1
N$18
  Bottom 1: B1.0 122.07,75.83 SERIAL_MEGA.2
N$21
  Bottom 1.016: STATE.K 128.92,75.05 330.2
N$23
  Bottom 0.813: R17.2 93.9,125.21 93.01,126.1 43.8,126.1 43.8,131.1 Q5.B
N$24
  Bottom 1: LED4.K 174.5,20.4 168.5,20.4 2.33K.2
N$25
  Bottom 2.54: F4.2 162.09,62.52 155.61,62.52 154.2,61.11 154.2,31.03 155.12,30.11 D1.A
N$26
  Bottom 0.813: Q6.B 122.16,131.36 118.2,127.4 110.5,127.4 108.7,125.6 R20.2
N$27
  Bottom 1: LED1.A R1.2
N$28
  Bottom 1: LED2.A 51.61,136.88 R2.2
N$29
  Bottom 1: LED5.A 74.43,137.58 72.93,137.58 R3.2
N$30
  Bottom 1: LED6.A 90.82,138.3 R4.2
N$31
  Bottom 1: LED7.A 115.52,137.84 115.32,137.64 R5.2
N$32
  Bottom 1: LED8.A 137.23,136.66 R6.2
N$33
  Bottom 1: LED9.A 157.85,136.62 156.38,138.09 R7.2
N$35
  Bottom 1.016: B1.23 112.38,109.28 113.62,110.7 121.62,110.7 122.75,111.77 122.75,112.15 ULTRASONIC1.3
N$36
  Bottom 1: 110,110.8 111.35,112.15 111.4,112.15
  Bottom 1.016: B1.25 110,109.01 110,110.8 | 111.4,112.15 120,112.15 120.21,112.24 ULTRASONIC1.2
N$37
  Bottom 1: 11.08,25.71 15.13,25.71 U$1.A5
  Bottom 1.016: 11.08,25.71 5.8,30.99 IMU.6
N$38
  Bottom 1.016: U$1.A4 11.16,28.37 6,33.53 IMU.5
N$39
  Bottom 1.016: ANALOG_NANO.1 10.5,33.43 13.03,30.9 U$1.A3 | 16,30.9 U$1.A3 | U$1.A3
N$40
  Bottom 1.016: ANALOG_NANO.2 11,35.97 13.52,33.45 U$1.A2
N$41
  Bottom 1: 61.44,113.88 61.44,111.94 64.07,109.3 68.14,109.3 68.14,105.23 68.48,104.89 68.49,104.88 68.49,104.87 68.91,104.48 69.3,104.08 69.32,104.08 71.03,102.37
  Bottom 1.016: ULTRASONIC.2 61.44,113.88 | 71.03,102.37 74.91,102.37 76.82,104.28 B1.50
N$42
  Bottom 1: ULTRASONIC.3 63.98,113.62 66.4,111.2 69.2,111.2 69.8,110.6 69.8,109.65
  Bottom 1.016: ULTRASONIC.3 63.98,115.94 | B1.52 74.28,105.18 73,103.9 71.6,103.9 69.87,105.5 69.8,109.65
N$43
  Bottom 1.016: U$1.A7 9.35,20.75 8.57,21.53 ANALOG_NANO2.1
N$44
  Bottom 1.016: U$1.A6 15.15,23.39 10.85,23.39 10.17,24.07 ANALOG_NANO2.2
N$45
  Bottom 1: JP4.1 66.46,63.33 B1.A0
N$46
  Bottom 0.813: 110,102.62 120.64,102.62
  Bottom 1: B1.26 107.3,103.9 108.58,102.62 110,102.62 121.53,102.62 123.27,104.37 JP1.1
N$47
  Bottom 1.016: ANALOG_SPARE.10 62.18,81.32 B1.A6
N$48
  Bottom 1: JP4.2 60,65.67 B1.A1
N$50
  Bottom 0.813: 104.76,104.14 B1.28
  Bottom 1: JP1.2 123.83,101.83 122.9,100.9 108,100.9 104.76,104.14
N$54
  Bottom 0.813: 99.68,101.88 99.64,65.95 79,65.9 78,65.9 78,33.9 69.03,23.8 62.9,23.8 | 62.9,23.8 62.03,23.8 | 62.03,23.8 61.05,23.73 | 61.86,23.76 62.03,23.8 | JP3.1 61.1,23.8 62,23.8 | 62,23.8 62.01,23.79 | 62,23.8 62.9,23.8
  Bottom 1.016: 99.68,101.88 99.68,102.22 B1.32
N$55
  Bottom 0.813: 76.62,61.43 76.63,62.9 | 76.63,62.9 76.67,67.9 97,67.9 97,106.17 | 76.63,62.9 76.63,34.53 68.05,25.26 57.8,25.26 JP3.2
  Bottom 1.016: B1.34 97,106.17
N$60
  Bottom 0.813: Q1.B 106.66,132.36 104.2,129.9 104.2,125.9
  Bottom 1: 104.2,125.9 R15.2
N$61
  Bottom 0.813: Q2.B 59.76,131.76 62.72,128.8 96.7,128.8 97.1,128.4 R16.2
N$62
  Bottom 0.813: R18.2 100.7,131.6 99.5,132.8 86.24,132.8 84.8,131.36 76.76,131.36 Q4.B
N$63
  Bottom 0.813: R19.2 114.59,124.4 135.9,124.4 142.52,131.02 152.02,131.02
  Bottom 1: 152.02,131.02 Q3.B
N$64
  Bottom 0.813: Q7.B 25.06,127.53 29.49,123.1 90.54,123.1 R21.2
N$75
  Bottom 1.016: DIGITAL_SPARE_MEGA1.7 88.12,111.78 88.52,111.38 B1.41
N$76
  Bottom 1.016: DIGITAL_SPARE_MEGA1.5 83.04,111.37 84.44,109.46 B1.45
N$77
  Bottom 1.016: DIGITAL_SPARE_MEGA1.6 85.58,111.32 86,110.9 87,108.87 B1.43
N$78
  Bottom 1.016: DIGITAL_SPARE_MEGA1.4 80.5,111.4 80.65,111 81.9,109 B1.47
N$79
  Bottom 1.016: DIGITAL_SPARE_MEGA1.3 77,115.86 78,111.9 79.36,109.54 B1.49
N$80
  Bottom 1.016: DIGITAL_SPARE_MEGA1.2 76.42,111.48 76.82,109.08 B1.51
N$81
  Bottom 1.016: DIGITAL_SPARE_MEGA1.1 73.86,111.27 74.28,108.62 B1.53
N$122
  Bottom 1.016: U$1.D12 30.49,51.66 ULTRASONIC2.2
N$123
  Bottom 1.016: U$1.D11 33,43.61 33,49.12 ULTRASONIC2.3
N$124
  Bottom 1.016: U$1.D10 35,41.07 35,39.9 38.35,39.9 ULTRASONIC3.2
N$125
  Bottom 1.016: U$1.D9 34,38.53 34,37.9 38.35,37.9 ULTRASONIC3.3
N$126
  Bottom 1.016: U$1.D8 30.49,35.32 35.8,35.32 35.8,32.34 DIGITAL_SPARE_NANO.1
N$127
  Bottom 1.016: U$1.D7 34.24,33.45 34.24,29.8 DIGITAL_SPARE_NANO.2
N$128
  Bottom 1.016: U$1.D6 32.75,30.9 32.75,27.44 38.4,27.44 DIGITAL_SPARE_NANO.3
N$135
  Bottom 1.016: U$1.RX1 35.35,13.13 SERIAL_NANO.1
N$136
  Bottom 1.016: U$1.TX0 35.35,10.59 SERIAL_NANO.2
PWM.A
  Bottom 1.016: B1.12 115.61,43.39 115.69,43.39 117.17,41.9 120.8,41.9 120.8,38.49 128.58,31.16 129.2,31.15 DRIVER.1.2
PWM.B
  Bottom 1: DRIVER.1.4 129.25,36.29 125.29,36.29
  Bottom 1.016: B1.11 116.28,46.62 117.58,45.32 117.58,45.31 119,43.9 122.4,43.9 122.4,39.18 125.29,36.29
PWM.C
  Bottom 1.016: B1.9 122.2,51.7 123,50.9 125.06,50.9 DRIVER.2.2
PWM.D
  Bottom 1.016: B1.10 117.74,49.16 119,47.9 119,45.9 125.06,45.9 DRIVER.2.4
PWM.E
  Bottom 1.016: B1.8 116.42,56.11 131.14,56.17 131.22,53.64 131.51,53.5 DRIVER.3.2
PWM.F
  Bottom 1.016: B1.7 115,57.9 115.16,57.74 123.84,57.74 123.85,57.73 129.14,57.73 133.36,58.06 DRIVER.3.4
PWM.G
  Bottom 1.016: B1.6 115.26,60.25 120.95,60.19 122,60.24 122,61.9 123.4,61.94 123.44,61.98 DRIVER.4.2
PWM.H
  Bottom 0.813: B1.4 120.77,65.67 122.27,67.17 DRIVER.4.4
RESET.MEGA
  Bottom 0.813: U$2.2 59.04,38.18 1K.1 67.28,38.18 68.55,39.85 68.55,44.85 68.55,45.35 B1.RESET
RX.BLUE
  Bottom 1.016: BLUETOOTH.2 122.03,85.68 122,83.9 122,80.9 122.3,80.6 1.1K.1 127.51,80.63 127.51,80.03 2.32K.2 127.6,79.88
RX.NANO
  Bottom 1.016: U$1.D5 28,28.37 28,56.4 46.78,56.4 46.77,15.7 84.97,15.89 84.9,48.12 85.04,48.54 109.69,48.55 109.69,83.59 112.09,85.99 B1.16
STATE  (via drill 1)
  Top 1: v102.3,78.8 102.4,78.7 111.4,78.7 v111.6,78.5
  Bottom 1: STATE.A 126.44,77.76 125.7,78.5 v111.6,78.5 | v102.3,78.8 101.9,79.2 102.22,79.52 B1.30
  Bottom 1.016: BLUETOOTH.1 129.31,83.12 129.34,79.8 129.33,78.09 128.86,77.76 STATE.A
TX.BLUE
  Bottom 1.016: B1.15 117.55,83.45 117.54,88.26 BLUETOOTH.3
TX.MEGA
  Bottom 1.016: B1.14 118.23,80.6 1.1K.2
TX.NANO
  Bottom 1.016: U$1.D4 26,25.83 26,58.2 49,58.2 49,17.9 82.93,18.17 82.93,48.8 84.14,50.03 107.92,50.03 107.97,50.09 108,84.9 111.63,88.53 B1.17